# Altium project Arb_Power_Booster.PrjPcb (part 1 of 2)
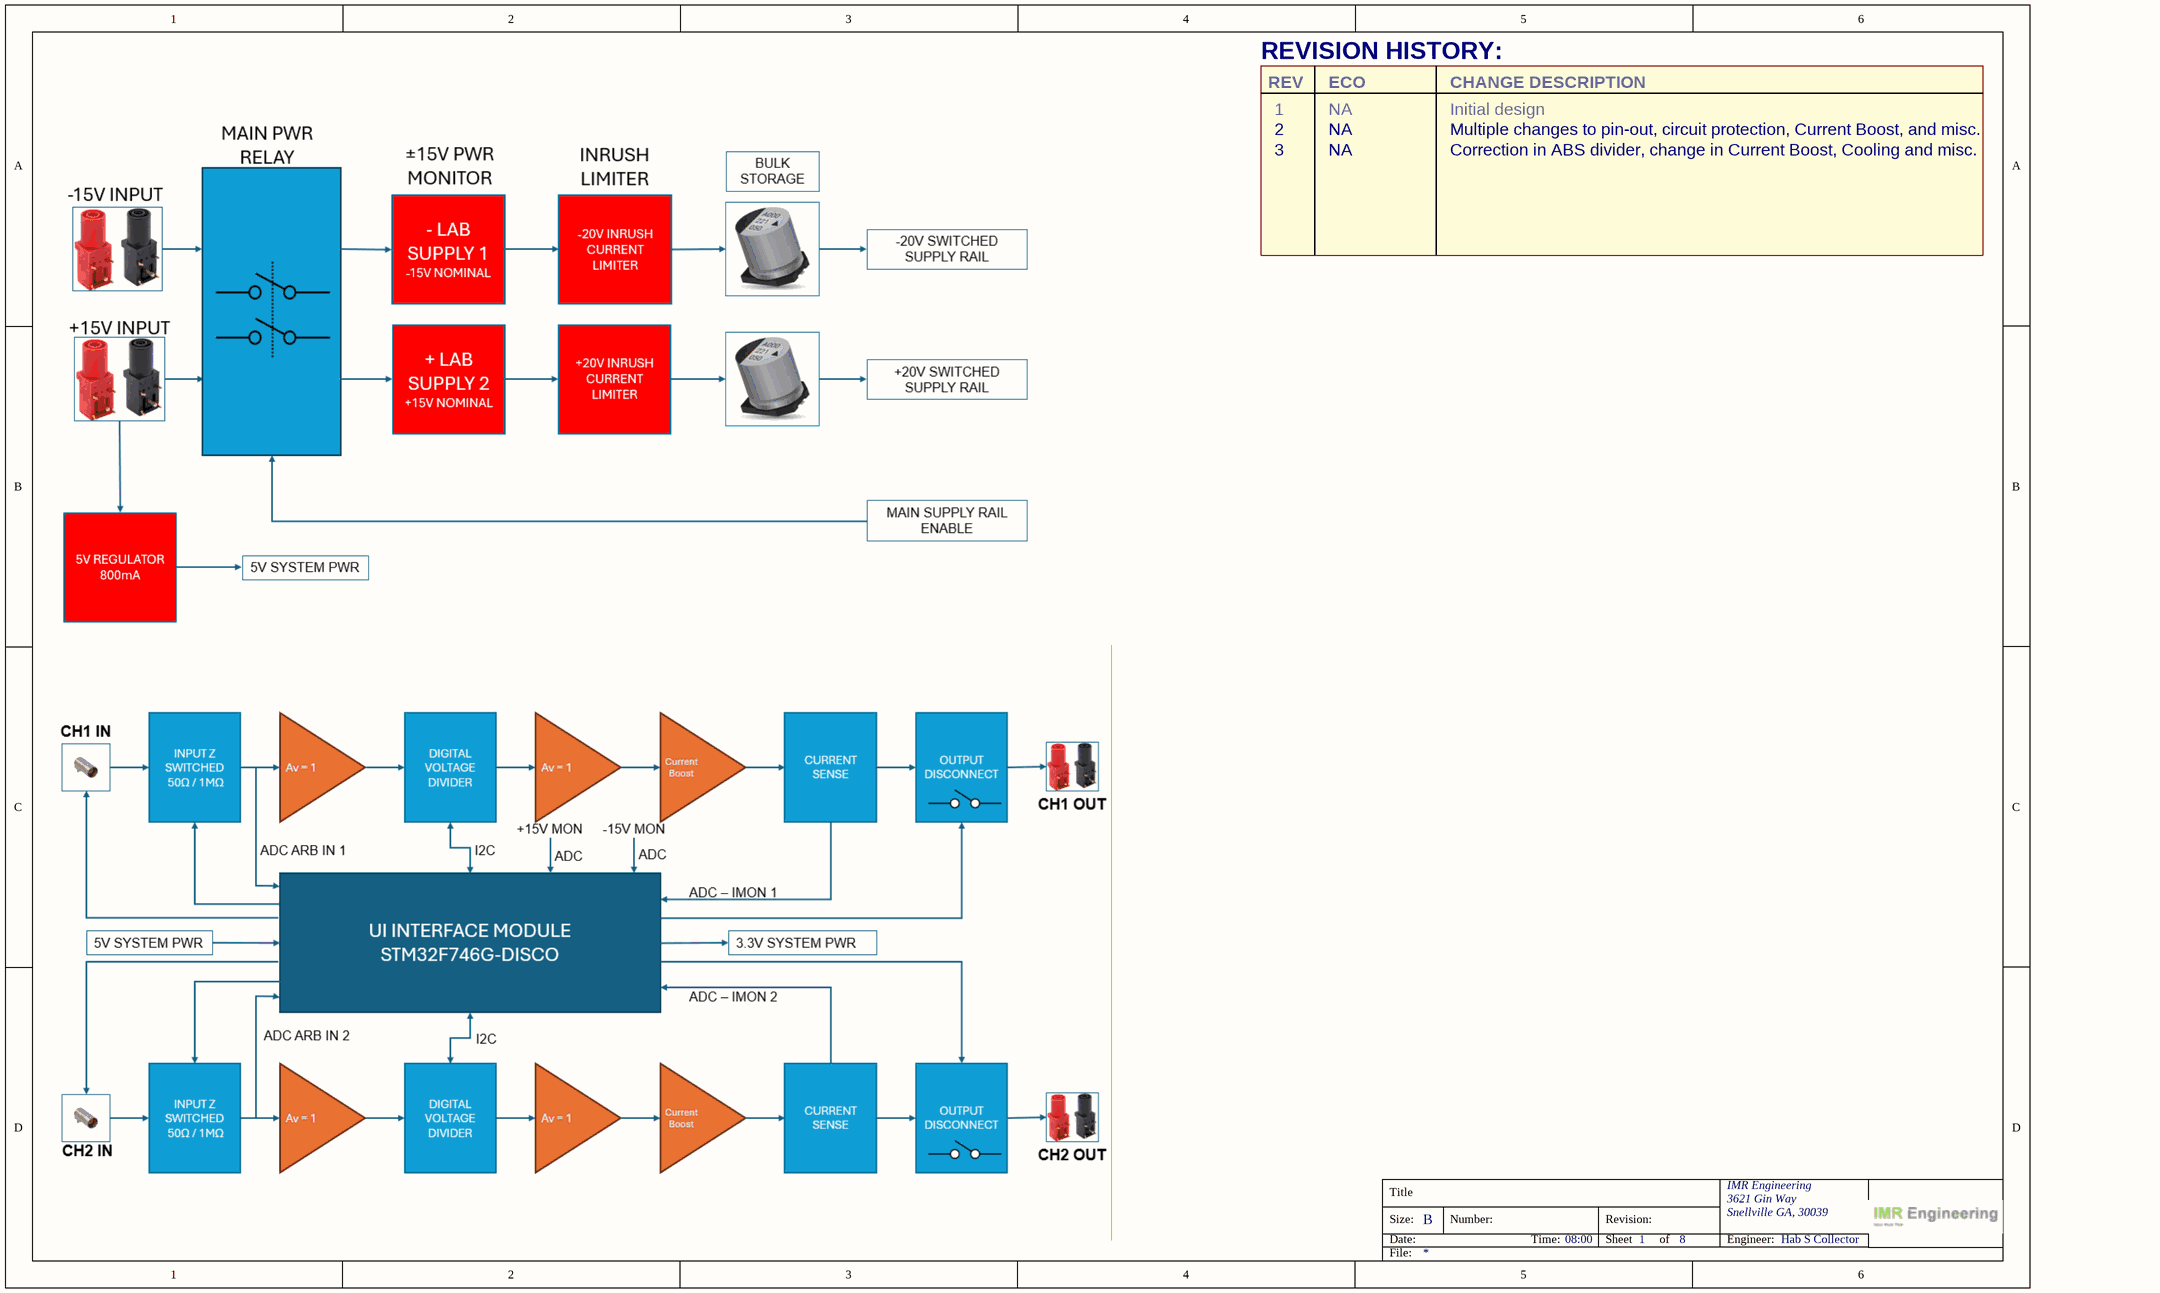
[diagram p0: ArbPwrBoost_P1.SchDoc]
ProjectTitle: Arbitrary Power Booster; ProjectTime: 08:00; ProjectRevision: 4; ProjectDocumentNumber: IMR-005-SCH; ProjectDate: 05/12/25
8 sheets, 228 parts. Net scope: global (net labels, ports and power ports of the same name join across sheets).
Sheets:
  ArbPwrBoost_P1.SchDoc
  ArbPwrBoost_P2.SchDoc
  ArbPwrBoost_P3.SchDoc
  ArbPwrBoost_P4.SchDoc
  ArbPwrBoost_P5.SchDoc
  ArbPwrBoost_P6.SchDoc
  ArbPwrBoost_P7.SchDoc
  ArbPwrBoost_P8.SchDoc

## Sheet ArbPwrBoost_P1.SchDoc: =ProjectTitle
size B; Date: 05/12/25; Engineer: Hab S Collector; Address1: 3621 Gin Way; Address2: Snellville GA, 30039; DocumentNumber: IMR-005-SCH; Revision: 4; SheetNumber: 1; SheetTotal: 8

### Notes on the sheet
- REVISION HISTORY:
- REV
- ECO
- CHANGE DESCRIPTION
- 1
- 2
- 3
- NA
- Initial design
- Multiple changes to pin-out, circuit protection, Current Boost, and misc.
- Correction in ABS divider, change in Current Boost, Cooling and misc.
- Title
- Size:
- Date:
- B
- Number:
- Time:
- Revision:
- Sheet
- of
- IMR Engineering
- Engineer:
- File:

## Sheet ArbPwrBoost_P2.SchDoc: =ProjectTitle
size B; Date: 05/12/25; Engineer: Hab S Collector; Address1: 3621 Gin Way; Address2: Snellville GA, 30039; DocumentNumber: IMR-005-SCH; Revision: 4; SheetNumber: 2; SheetTotal: 8
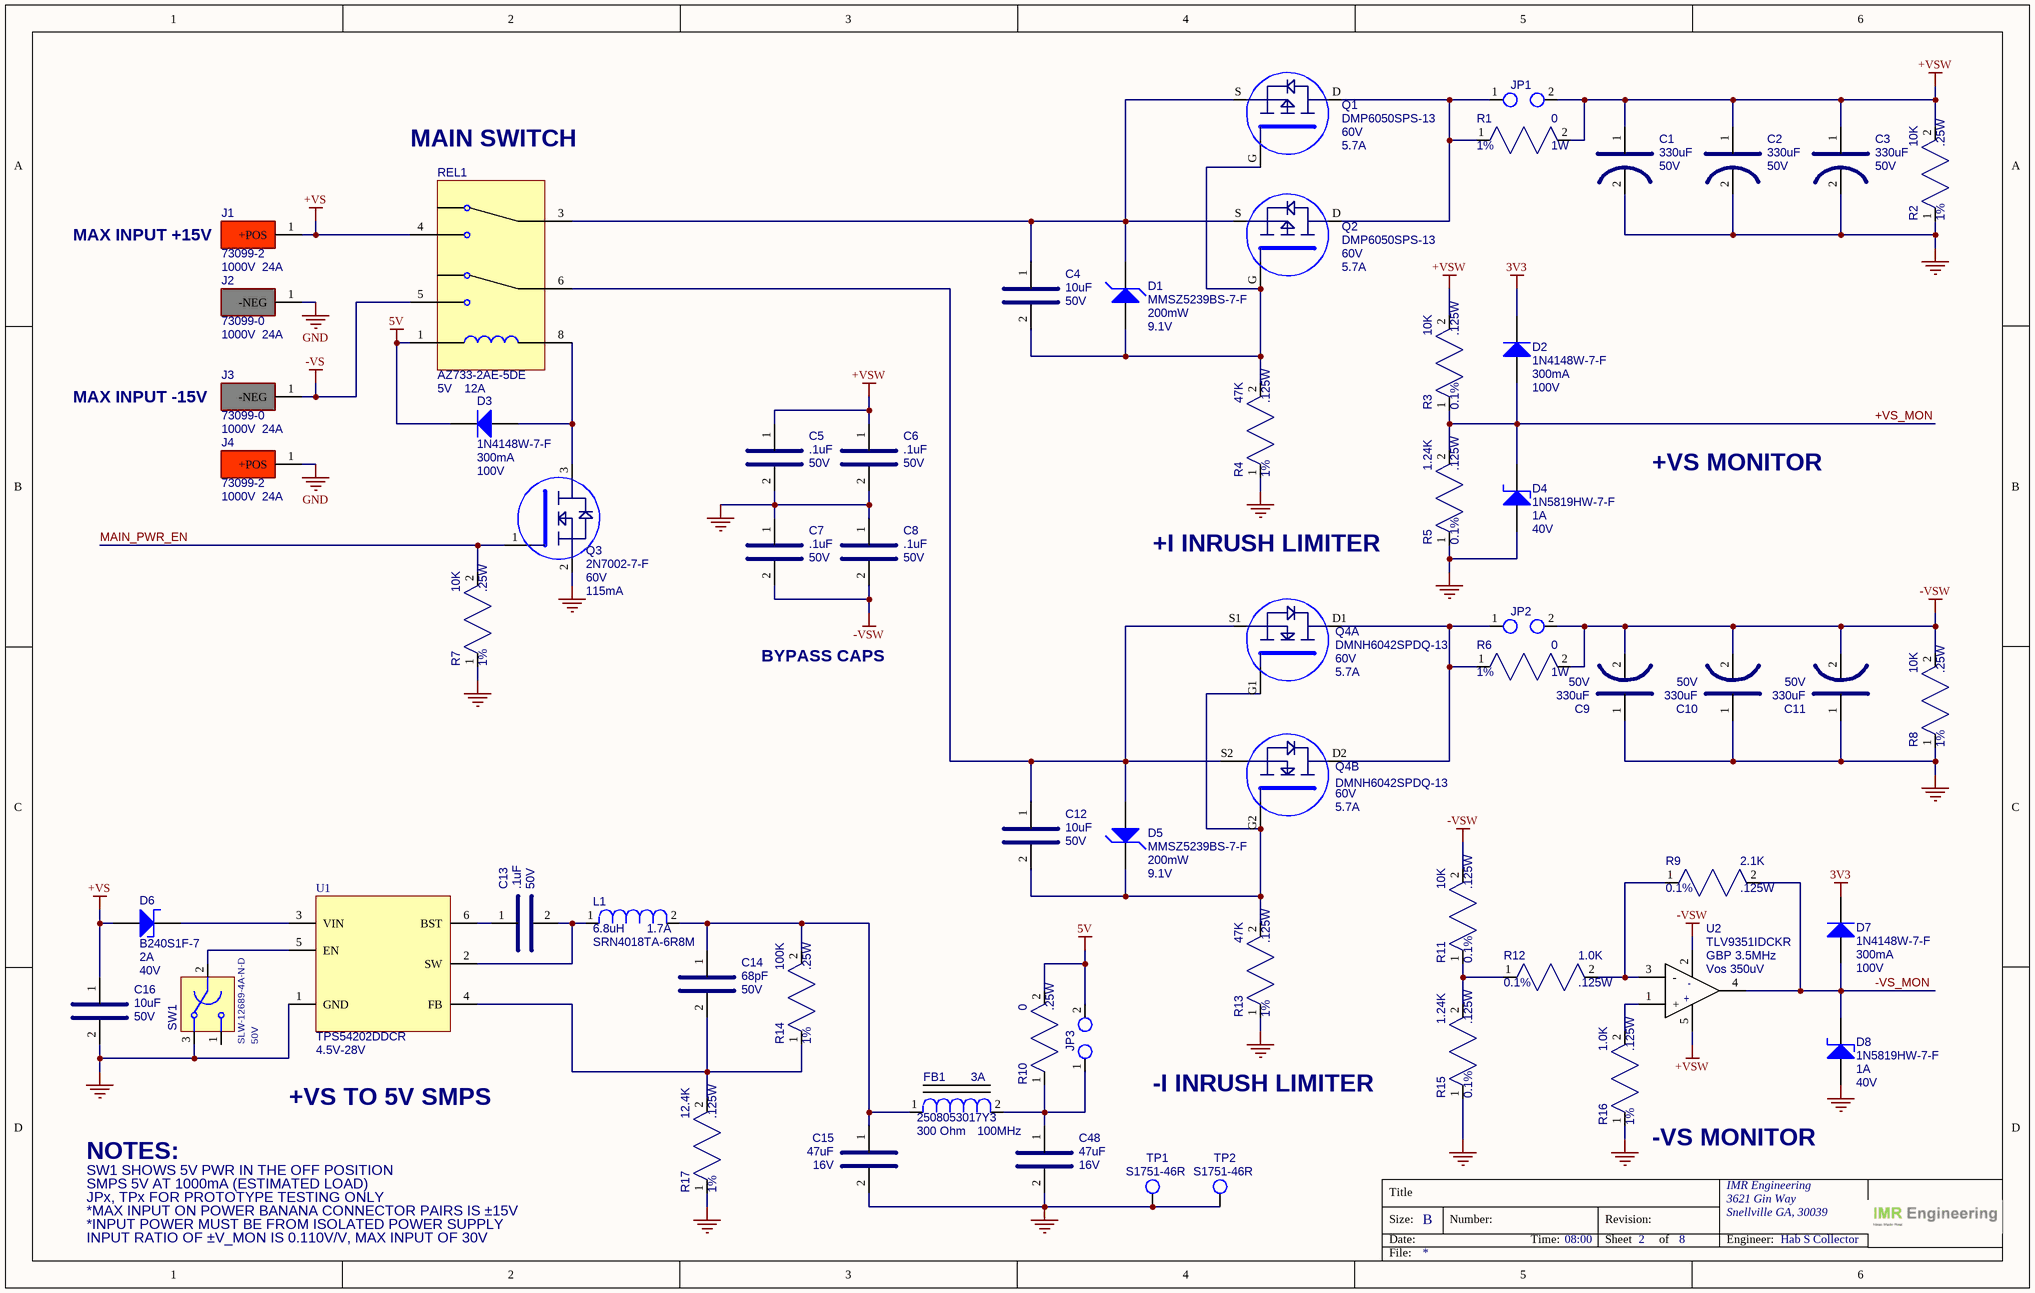
[diagram p1: ArbPwrBoost_P2.SchDoc]

### Parts
C1  value 330uF  Voltage: 50V  [PANASONIC_EEEFK0J332AQ]  (hidden comment: Panasonic Electronic)
C2  value 330uF  Voltage: 50V  [PANASONIC_EEEFK0J332AQ]  (hidden comment: Panasonic Electronic)
C3  value 330uF  Voltage: 50V  [PANASONIC_EEEFK0J332AQ]  (hidden comment: Panasonic Electronic)
C4  value 10uF  Voltage: 50V  [CAP_0805]  (hidden comment: GRM21BR61H106KE43L)
C5  value .1uF  Voltage: 50V  [CAP_0805]  (hidden comment: KGM21NR71H104KT)
C6  value .1uF  Voltage: 50V  [CAP_0805]  (hidden comment: KGM21NR71H104KT)
C7  value .1uF  Voltage: 50V  [CAP_0805]  (hidden comment: KGM21NR71H104KT)
C8  value .1uF  Voltage: 50V  [CAP_0805]  (hidden comment: KGM21NR71H104KT)
C9  value 330uF  Voltage: 50V  [PANASONIC_EEEFK0J332AQ]  (hidden comment: Panasonic Electronic)
C10  value 330uF  Voltage: 50V  [PANASONIC_EEEFK0J332AQ]  (hidden comment: Panasonic Electronic)
C11  value 330uF  Voltage: 50V  [PANASONIC_EEEFK0J332AQ]  (hidden comment: Panasonic Electronic)
C12  value 10uF  Voltage: 50V  [CAP_0805]  (hidden comment: GRM21BR61H106KE43L)
C13  value .1uF  Voltage: 50V  [CAP_0805]  (hidden comment: KGM21NR71H104KT)
C14  value 68pF  Voltage: 50V  [CAP_0805]  (hidden comment: C0805C680K5RACAUTO)
C15  value 47uF  Voltage: 16V  [CAP_1210]  (hidden comment: GRM32ER60J476ME20L)
C16  value 10uF  Voltage: 50V  [CAP_0805]  (hidden comment: GRM21BR61H106KE43L)
C48  value 47uF  Voltage: 16V  [CAP_1210]  (hidden comment: GRM32ER60J476ME20L)
D1  value 9.1V  Power: 200mW  [SOD323]  (hidden comment: MMSZ5239BS-7-F)
D2  value 100V  Current: 300mA  [SOD123]  (hidden comment: 1N4148W-7-F)
D3  value 100V  Current: 300mA  [SOD123]  (hidden comment: 1N4148W-7-F)
D4  value 40V  Current: 1A  [SOD123]  (hidden comment: 1N5819HW-7-F)
D5  value 9.1V  Power: 200mW  [SOD323]  (hidden comment: MMSZ5239BS-7-F)
D6  value 40V  Current: 2A  [SOD123F]  (hidden comment: B240S1F-7)
D7  value 100V  Current: 300mA  [SOD123]  (hidden comment: 1N4148W-7-F)
D8  value 40V  Current: 1A  [SOD123]  (hidden comment: 1N5819HW-7-F)
FB1  value 300 Ohm  Frequency: 100MHz  Current: 3A  [FERRITE_0805]  (hidden comment: 2508053017Y3)
J1  value 1000V  Current: 24A  [Pomona_73099-2]  (hidden comment: 73099-2)
J2  value 1000V  Current: 24A  [Pomona_73099-0]  (hidden comment: 73099-0)
J3  value 1000V  Current: 24A  [Pomona_73099-0]  (hidden comment: 73099-0)
J4  value 1000V  Current: 24A  [Pomona_73099-2]  (hidden comment: 73099-2)
JP1  PREC002SFAN-RC  [HDR_1X2_100MILL]  (value not drawn)
JP2  PREC002SFAN-RC  [HDR_1X2_100MILL]  (value not drawn)
JP3  PREC002SFAN-RC  [HDR_1X2_100MILL]  (value not drawn)
L1  value 6.8uH  Current: 1.7A  [SRN4018TA]  (hidden comment: SRN4018TA-6R8M)
Q1  value 60V  Current: 5.7A  [DMP3007SPS13]  (hidden comment: DMP6050SPS-13)
Q2  value 60V  Current: 5.7A  [DMP3007SPS13]  (hidden comment: DMP6050SPS-13)
Q3  value 60V  Current: 115mA  [SOT-23]  (hidden comment: 2N7002-7-F)
Q4  value 60V  Current: 5.7A  [TRANS_DMP2002UPS-13]  (hidden comment: DMNH6042SPDQ-13)  (parts A,B of 2)
R1  value 0  Tolerance: 1%  Power: 1W  [RES_2512]  (hidden comment: RC2512JK-070RL)
R2  value 10K  Power: .25W  Tolerance: 1%  [RES_0805]  (hidden comment: RC0805FR-7W10KL)
R3  value 10K  Power: .125W  Tolerance: 0.1%  [RES_0805]  (hidden comment: RP0805BRD0710KL)
R4  value 47K  Power: .125W  Tolerance: 1%  [RES_0805]  (hidden comment: RC0805FR-1347KL)
R5  value 1.24K  Power: .125W  Tolerance: 0.1%  [RES_0805]  (hidden comment: RT0805BRD071K24L)
R6  value 0  Tolerance: 1%  Power: 1W  [RES_2512]  (hidden comment: RC2512JK-070RL)
R7  value 10K  Power: .25W  Tolerance: 1%  [RES_0805]  (hidden comment: RC0805FR-7W10KL)
R8  value 10K  Power: .25W  Tolerance: 1%  [RES_0805]  (hidden comment: RC0805FR-7W10KL)
R9  value 2.1K  Power: .125W  Tolerance: 0.1%  [RES_0805]  (hidden comment: RT0805BRD072K1L)
R10  value 0  Power: .25W  [RES_0805]  (hidden comment: RC0805JR-070RL)
R11  value 10K  Power: .125W  Tolerance: 0.1%  [RES_0805]  (hidden comment: RP0805BRD0710KL)
R12  value 1.0K  Power: .125W  Tolerance: 0.1%  [RES_0805]  (hidden comment: RT0805BRD071KL)
R13  value 47K  Power: .125W  Tolerance: 1%  [RES_0805]  (hidden comment: RC0805FR-1347KL)
R14  value 100K  Power: .25W  Tolerance: 1%  [RES_0805]  (hidden comment: RC0805FR-07100KL)
R15  value 1.24K  Power: .125W  Tolerance: 0.1%  [RES_0805]  (hidden comment: RT0805BRD071K24L)
R16  value 1.0K  Power: .125W  Tolerance: 1%  [RES_0805]  (hidden comment: RC0805FR-071KL)
R17  value 12.4K  Power: .125W  Tolerance: 1%  [RES_0805]  (hidden comment: RC0805FR-0712K4L)
REL1  value 5V  Current: 12A  [AZ733]  (hidden comment: AZ733-2AE-5DE)
SW1  value 50V  [SLW126894AND]  (hidden comment: SLW-12689-4A-N-D)
TP1  S1751-46R  [HARWIN_S1751]
TP2  S1751-46R  [HARWIN_S1751]
U1  value 4.5V-28V  [SOT-23-6]  (hidden comment: TPS54202DDCR)
U2  value GBP 3.5MHz  Vos: Vos 350uV  [SOT-353]  (hidden comment: TLV9351IDCKR)

### Nets
3V3: D2.2(K) D7.2(K)
5V: D3.2(K) JP3.2 R10.2 REL1.1
+VS: C16.1 D6.1(A) J1.1(+POS) REL1.4
+VSW: C1.1 C2.1 C3.1 C5.1 C6.1 JP1.2 R1.2 R2.2 R3.2 U2.5
-VS: J3.1(-NEG) REL1.5
-VSW: C7.2 C8.2 C9.2 C10.2 C11.2 JP2.2 R6.2 R8.2 R11.2 U2.2
GND: C1.2 C2.2 C3.2 C5.2 C6.2 C7.1 C8.1 C9.1 C10.1 C11.1 C15.2 C16.2 C48.2 D4.1(A) D8.1(A) J2.1(-NEG) J4.1(+POS) Q3.2(E) R2.1 R4.1 R5.1 R7.1 R8.1 R13.1 R15.1 R16.1 R17.1 SW1.3 TP1.1 TP2.1 U1.1(GND)
+VS_MON: D2.1(A) D4.2(K) R3.1 R5.2
-VS_MON: D7.1(A) D8.2(K) R9.2 U2.4
MAIN_PWR_EN: Q3.1(B) R7.2
NetC4_1: C4.1 D1.2(K) Q1.S Q2.S REL1.3
NetC4_2: C4.2 D1.1(A) Q1.G Q2.G R4.2
NetC12_1: C12.1 D5.1(A) Q4.S1(S) Q4.S2(S) REL1.6
NetC12_2: C12.2 D5.2(K) Q4.G1(G) Q4.G2 R13.2
NetC13_1: C13.1 U1.6(BST)
NetC13_2: C13.2 L1.1 U1.2(SW)
NetC14_1: C14.1 C15.1 FB1.1 L1.2 R14.2
NetC14_2: C14.2 R14.1 R17.2 U1.4(FB)
NetC48_1: C48.1 FB1.2 JP3.1 R10.1
NetD3_1: D3.1(A) Q3.3(C) REL1.8
NetD6_2: D6.2(K) U1.3(VIN)
NetJP1_1: JP1.1 Q1.D Q2.D R1.1
NetJP2_1: JP2.1 Q4.D1(D) Q4.D2(D) R6.1
NetR9_1: R9.1 R12.2 U2.3(-)
NetR11_1: R11.1 R12.1 R15.2
NetR16_2: R16.2 U2.1(+)
NetSW1_2: SW1.2 U1.5(EN)

Not connected (* = marked no-connect by the designer): SW1 1

### Notes on the sheet
- MAIN SWITCH
- MAX INPUT +15V
- MAX INPUT -15V
- +VS MONITOR
- +I INRUSH LIMITER
- BYPASS CAPS
- +VS TO 5V SMPS
- -I INRUSH LIMITER
- NOTES:
- SW1 SHOWS 5V PWR IN THE OFF POSITION
- (near R16) -VS MONITOR
- JPx, TPx FOR PROTOTYPE TESTING ONLY
- *MAX INPUT ON POWER BANANA CONNECTOR PAIRS IS ±15V
- *INPUT POWER MUST BE FROM ISOLATED POWER SUPPLY
- INPUT RATIO OF ±V_MON IS 0.110V/V, MAX INPUT OF 30V
- SMPS 5V AT 1000mA (ESTIMATED LOAD)
- Title
- Size:
- Date:
- B
- Number:
- Time:
- Revision:
- Sheet
- of
- IMR Engineering
- Engineer:
- File:

### Library data of the parts
C1-C3 C9-C11 = CAP_330UF_50V_ALE: CAP ALE 330UF 20% 50V SMD; MFG: EEV-FK1H331Q; Case/Package: Radial SMD; MFG_PN: Panasonic Electronic; Supplier 1: DigiKey; Supplier Part Number 1: PCE3475CT-ND; Unit Price: 1.41
C4 C12 C16 = CAP_SMD_10UF_50V_0805: CAP CER 10UF 50V X5R 0805; MFG: Murata Electronics; Case/Package: 0805; MFG_PN: GRM21BR61H106KE43L; Supplier 1: DigiKey; Supplier Part Number 1: 490-18663-1-ND; Unit Price: .28
C5-C8 C13 = CAP_SMD_0.1UF_50V_0805: CAP CER 0.1UF 50V X7R 0805; MFG: KYOCERA AVX; Case/Package: 0805; MFG_PN: KGM21NR71H104KT; Supplier 1: DigiKey; Supplier Part Number 1: 478-KGM21NR71H104KTCT-ND; Unit Price: .1
C14 = CAP_SMD_68PF_50V_0805: CAP CER 68PF 50V X7R 0805; MFG: KEMET; Case/Package: 0805; MFG_PN: C0805C680K5RACAUTO; Supplier 1: DigiKey; Supplier Part Number 1: 399-C0805C680K5RACAUTOCT-ND; Unit Price: .24
C15 C48 = CAP_SMD_47UF_16V_1210: CAP CER 47UF 50V X5R 1210; MFG: Murata Electronics; Case/Package: 1210; MFG_PN: GRM32ER60J476ME20L; Supplier 1: DigiKey; Supplier Part Number 1: 490-1887-1-ND; Unit Price: .28
D1 D5 = DIODE_ZENER_MMSZ5239BS-7-F: DIODE ZENER 9.1V 200MW SOD323; MFG: Diodes Inc; Case/Package: SOD-123; Supplier 1: DigiKey; Supplier Part Number 1: MMSZ5239BS-FDICT-ND; Unit Price: .18; MFG_PN: MMSZ5239BS-7-F
D2 D3 D7 = DIODE_1N4148W-7-F: RELAY REED SPDT 250MA 5V; MFG: Diodes Inc; Case/Package: SOD-123; Supplier 1: DigiKey; Supplier Part Number 1: 1N4148W-FDICT-ND; Unit Price: .16; MFG_PN: 1N4148W-7-F
D4 D8 = DIODE_SCHOTTKY_1N5819HW-7-F: DIODE SCHOTTKY 40V 1A SOD123; MFG: Diodes Inc; Case/Package: SOD-123; Supplier 1: DigiKey; Supplier Part Number 1: 1N5819HW-FDICT-ND; Unit Price: .25; MFG_PN: 1N5819HW-7-F
D6 = DIODE_SCHOTTKY_B240S1F-7: DIODE SCHOTTKY 40V 2A SOD123F; MFG: Diodes Inc; Case/Package: SOD-123F; Supplier 1: DigiKey; Supplier Part Number 1: B240S1F-7DICT-ND; Unit Price: .25; MFG_PN: B240S1F-7
FB1 = FERRITE_2508053017Y3: FERRITE BEAD 300 OHM 0805 1LN; MFG: Fair-Rite; Case/Package: 0805; Supplier 1: DigiKey; Supplier Part Number 1: 1934-1474-1-ND; Unit Price: .10; MFG_PN: 2508053017Y3
J1 J4 = CONN_PANOMA_73099-2: CONN 4mm Banana Socket Right Angle PCB RED; MFG: Pomona; Case/Package: 73099-2; Supplier 1: DigiKey; Supplier Part Number 1: 501-73099-2-ND; Unit Price: 10.39; MFG_PN: 73099-2
J2 J3 = CONN_PANOMA_73099-0: CONN 4mm Banana Socket Right Angle PCB BLK; MFG: Pomona; Case/Package: 73099-0; Supplier 1: DigiKey; Supplier Part Number 1: 501-73099-0-ND; Unit Price: 10.39; MFG_PN: 73099-0
JP1-JP3 = CONN_JUMPER_2P_100MIL_VERT: CONN HEADER VERT 2POS 2.54MM; MFG: Sullins Connector Solutions; Case/Package: 2P_2.54MM; MFG_PN: PREC002SFAN-RC; Supplier 1: Digi-Key; Supplier Part Number 1: S1212EC-02-ND; Value: *; Unit Price: .07
L1 = INDUCTOR_SRN4018TA-6R8M: FIXED IND 6.8UH 1.7A 98 MOHM SMD; MFG: Bourns Inc.; Tolerance: 20%; Case/Package: SRN4018TA; Supplier 1: DigiKey; Supplier Part Number 1: SRN4018TA-6R8MCT-ND; Unit Price: .48; MFG_PN: SRN4018TA-6R8M
Q1 Q2 = MOSFET_PCH_DMP6050SPS-13: MOSFET P-CH 60V 5.7A PWRDI5060-8; MFG: Diodes Inc; Case/Package: 8-PowerTDFN; Supplier 1: DigiKey; Supplier Part Number 1: DMP6050SPS-13DICT-ND; Unit Price: 1.07; MFG_PN: DMP6050SPS-13
Q3 = MOSFET_NCH_2N7002-7-F: MOSFET N-CH 60V 115MA SOT23-3; MFG: Diodes Inc; Case/Package: SOT-23; Supplier 1: DigiKey; Supplier Part Number 1: 2N7002-FDICT-ND; Unit Price: .20; MFG_PN: 2N7002-7-F
Q4 = MOSFET_NCH_DMNH6042SPDQ-13: MOSFET NCH 60V 5.7A POWERDI; MFG: Diodes Inc; Case/Package: 8-PowerTDFN; Supplier 1: DigiKey; Supplier Part Number 1: DMNH6042SPDQ-13DICT-ND; Unit Price: 1.36; MFG_PN: DMNH6042SPDQ-13
R1 R6 = RES_SMD_0_2512_1W_1%: RES SMD 0 OHM 1% 1W 2512; MFG: Yageo; Case/Package: 2512; MFG_PN: RC2512JK-070RL; Supplier 1: DigiKey; Supplier Part Number 1: YAG1232CT-ND; Unit Price: .2
R2 R7 R8 = RES_SMD_10K_0805_1/4W_1%: RES SMD 10K OHM 1% 1/4W 0805; MFG: Yageo; Case/Package: 0805; MFG_PN: RC0805FR-7W10KL; Supplier 1: DigiKey; Supplier Part Number 1: 13-RC0805FR-7W10KLCT-ND; Unit Price: .10
R3 R11 = RES_SMD_10K_0805_1/8W_0.1%: RES SMD 10K OHM 0.1% 1/8W 0805; MFG: Yageo; Case/Package: 0805; MFG_PN: RP0805BRD0710KL; Supplier 1: DigiKey; Supplier Part Number 1: 13-RP0805BRD0710KLCT-ND; Unit Price: .16
R4 R13 = RES_SMD_47K_0805_1/8W_1%: RES SMD 47K OHM 1% 1/8W 0805; MFG: Yageo; Case/Package: 0805; MFG_PN: RC0805FR-1347KL; Supplier 1: DigiKey; Supplier Part Number 1: 13-RC0805FR-1347KLCT-ND; Unit Price: .1
R5 R15 = RES_SMD_1.24K_0805_1/8W_0.1%: RES SMD 1.24K OHM 0.1% 1/8W 0805; MFG: Yageo; Case/Package: 0805; MFG_PN: RT0805BRD071K24L; Supplier 1: DigiKey; Supplier Part Number 1: YAG1809CT-ND; Unit Price: .16
R9 = RES_SMD_2.1K_0805_1/8W_0.1%: RES SMD 2.1K OHM 0.1% 1/8W 0805; MFG: Yageo; Case/Package: 0805; MFG_PN: RT0805BRD072K1L; Supplier 1: DigiKey; Supplier Part Number 1: YAG1852CT-ND; Unit Price: .16
R10 = RES_SMD_0_0805_1/8W_1%: RES SMD 0 OHM 1% 1/8W 0805; MFG: Yageo; Case/Package: 0805; MFG_PN: RC0805JR-070RL; Supplier 1: DigiKey; Supplier Part Number 1: 311-0.0ARCT-ND; Unit Price: .1; Tolerance: 1%
R12 = RES_SMD_1.0K_0805_1/8W_0.1%: RES SMD 1.0K OHM 0.1% 1/8W 0805; MFG: Yageo; Case/Package: 0805; MFG_PN: RT0805BRD071KL; Supplier 1: DigiKey; Supplier Part Number 1: YAG1820CT-ND; Unit Price: .16
R14 = RES_SMD_100K_0805_1/4W_1%: RES SMD 100K OHM 1% 1/4W 0805; MFG: Yageo; Case/Package: 0805; MFG_PN: RC0805FR-07100KL; Supplier 1: DigiKey; Supplier Part Number 1: 311-100KCRCT-ND; Unit Price: .13
R16 = RES_SMD_1.0K_0805_1/8W_1%: RES SMD 1.0K OHM 1% 1/8W 0805; MFG: Yageo; Case/Package: 0805; MFG_PN: RC0805FR-071KL; Supplier 1: DigiKey; Supplier Part Number 1: 311-1.00KCRCT-ND; Unit Price: .1
R17 = RES_SMD_12.4K_0805_1/8W_1%: RES SMD 12.4K OHM 1% 1/8W 0805; MFG: Yageo; Case/Package: 0805; MFG_PN: RC0805FR-0712K4L; Supplier 1: DigiKey; Supplier Part Number 1: 311-12.4KCRCT-ND; Unit Price: .10
REL1 = RELAY_AZ733-2AE-5DE: RELAY REED SPDT 250MA 5V; MFG: American Zettler; Case/Package: AZ733; Supplier 1: DigiKey; Supplier Part Number 1: 3385-AZ733-2AE-5DE-nd; Unit Price: 2.18; MFG_PN: AZ733-2AE-5DE
SW1 = SWITCH_SLW-12689-4A-N-D: SWITCH SLIDE SPDT 300MA 50V; MFG: Same Sky; Case/Package: SLW-12689-4A-N-D; Supplier 1: DigiKey; Supplier Part Number 1: 2223-SLW-12689-4A-N-D-ND; Unit Price: .48; Current: 300mA; MFG_PN: SLW-12689-4A-N-D
TP1 TP2 = CONN_TEST_POINT_S1751-46R: PCB TEST POINT CONNECT; MFG: Harwin Inc; Case/Package: S1751; MFG_PN: S1751-46R; Supplier 1: Digi-Key; Supplier Part Number 1: 952-1478-1-ND; Value: *; Unit Price: .28
U1 = IC_TPS54202DDCR: IC REG BUCK ADJ 2A SOT23; MFG: Texas Instruments; Case/Package: SOT-23-6; Supplier 1: Digi-Key; Supplier Part Number 1: 296-TPS54202DDCRCT-ND; Unit Price: .97; MFG_PN: TPS54202DDCR
U2 = OPAMP_TLV9351IDCKR: IC OPAMP GP 3.5MHZ 350uV C70-5; MFG: Texas Instruments; Package/Case: SOT-353; Supplier 1: DigiKey; MFG_PN: TLV9351IDCKR; Unit Price: .49; Supplier Part Number 1: 296-TLV9351IDCKRCT-ND

## Sheet ArbPwrBoost_P3.SchDoc: =ProjectTitle
size B; Date: 05/12/25; Engineer: Hab Collector; Organization: Altium Limited; Address1: 3621 Gin Way; Address2: Snellville, GA 30039; DocumentNumber: IMR-005-SCH; Revision: 4; SheetNumber: 3; SheetTotal: 8
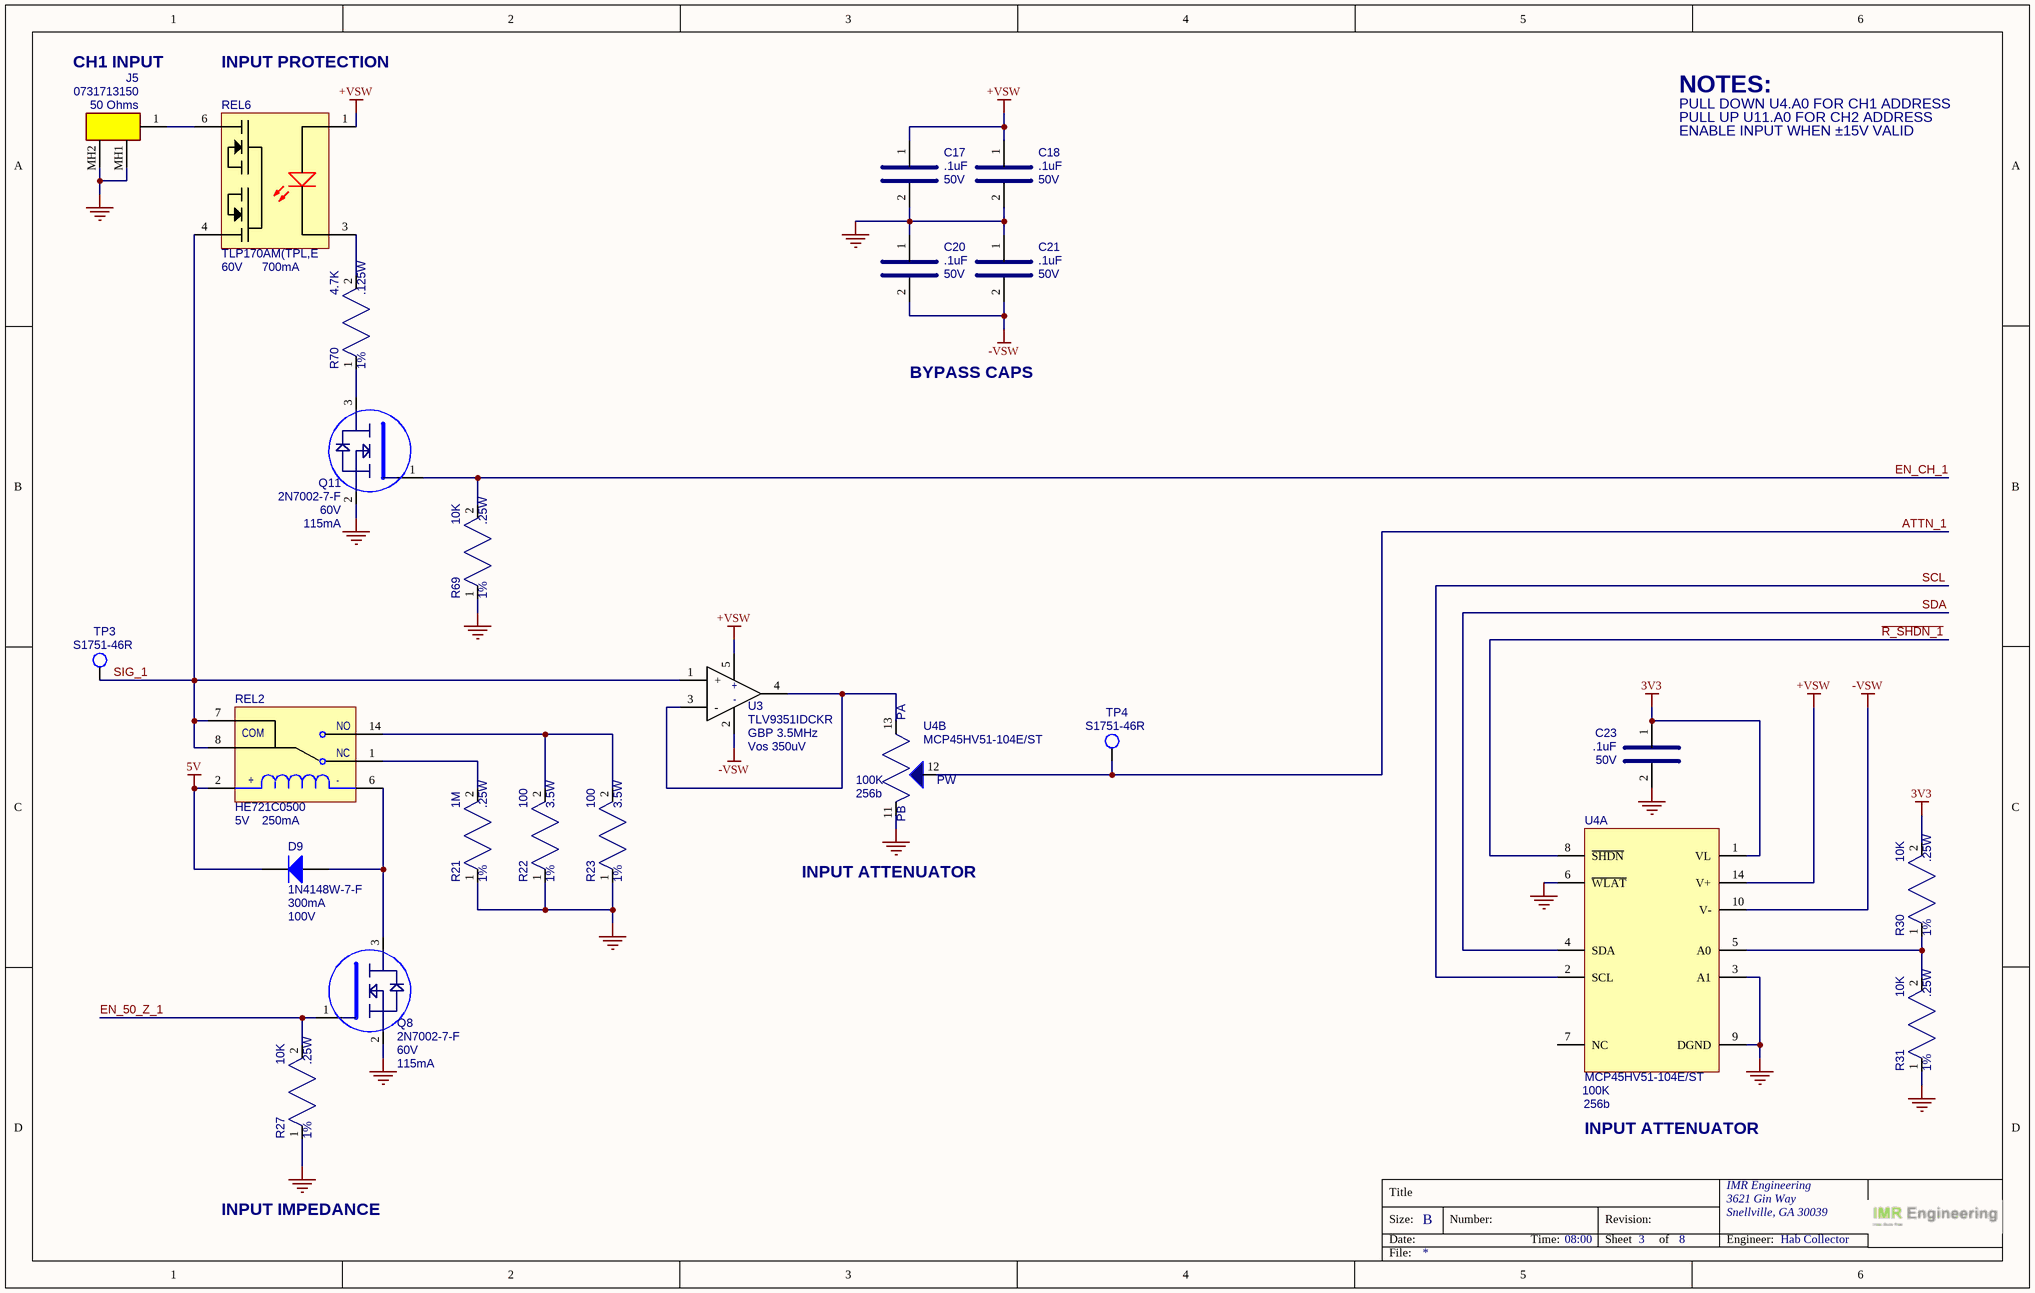
[diagram p2: ArbPwrBoost_P3.SchDoc]

### Parts
C17  value .1uF  Voltage: 50V  [CAP_0805]  (hidden comment: KGM21NR71H104KT)
C18  value .1uF  Voltage: 50V  [CAP_0805]  (hidden comment: KGM21NR71H104KT)
C20  value .1uF  Voltage: 50V  [CAP_0805]  (hidden comment: KGM21NR71H104KT)
C21  value .1uF  Voltage: 50V  [CAP_0805]  (hidden comment: KGM21NR71H104KT)
C23  value .1uF  Voltage: 50V  [CAP_0805]  (hidden comment: KGM21NR71H104KT)
D9  value 100V  Current: 300mA  [SOD123]  (hidden comment: 1N4148W-7-F)
J5  value 50 Ohms  [731713150]  (hidden comment: 0731713150)
Q8  value 60V  Current: 115mA  [SOT-23]  (hidden comment: 2N7002-7-F)
Q11  value 60V  Current: 115mA  [SOT-23]  (hidden comment: 2N7002-7-F)
R21  value 1M  Power: .25W  Tolerance: 1%  [RES_0805]  (hidden comment: RC0805FR-7W1ML)
R22  value 100  Power: 3.5W  Tolerance: 1%  [RES_2512]  (hidden comment: ALN2512F100RE-1)
R23  value 100  Power: 3.5W  Tolerance: 1%  [RES_2512]  (hidden comment: ALN2512F100RE-1)
R27  value 10K  Power: .25W  Tolerance: 1%  [RES_0805]  (hidden comment: RC0805FR-7W10KL)
R30  value 10K  Power: .25W  Tolerance: 1%  [RES_0805]  (hidden comment: RC0805FR-7W10KL)
R31  value 10K  Power: .25W  Tolerance: 1%  [RES_0805]  (hidden comment: RC0805FR-7W10KL)
R69  value 10K  Power: .25W  Tolerance: 1%  [RES_0805]  (hidden comment: RC0805FR-7W10KL)
R70  value 4.7K  Power: .125W  Tolerance: 1%  [RES_0805]  (hidden comment: RC0805FR-134K7L)
REL2  value 5V  Current: 250mA  [HE700]  (hidden comment: HE721C0500)
REL6  value 60V  Current: 700mA  [SOP-6]  (hidden comment: TLP170AM(TPL,E)
TP3  S1751-46R  [HARWIN_S1751]
TP4  S1751-46R  [HARWIN_S1751]
U3  value GBP 3.5MHz  Vos: Vos 350uV  [SOT-353]  (hidden comment: TLV9351IDCKR)
U4  value 100K  TAP: 256b  [TSSOP-14]  (hidden comment: MCP45HV51-104E/ST)  (parts A,B of 2)

### Nets
3V3: C23.1 R30.2 U4.1(VL)
5V: D9.2(K) REL2.2
+VSW: C17.1 C18.1 REL6.1 U3.5 U4.14(V+)
-VSW: C20.2 C21.2 U3.2 U4.10(V-)
GND: C17.2 C18.2 C20.1 C21.1 C23.2 J5.MH1 J5.MH2 Q8.2(E) Q11.2(E) R21.1 R22.1 R23.1 R27.1 R31.1 R69.1 U4.3(A1) U4.6(~{WLAT}) U4.9(DGND) U4.11(PB0)
~{R_SHDN_1}: U4.8(~{SHDN})
ATTN_1: TP4.1 U4.12(PW0)
EN_50_Z_1: Q8.1(B) R27.2
EN_CH_1: Q11.1(B) R69.2
SCL: U4.2(SCL)
SDA: U4.4(SDA)
SIG_1: REL2.7(COM) REL2.8(COM) REL6.4 TP3.1 U3.1(+)
NetD9_1: D9.1(A) Q8.3(C) REL2.6
NetJ5_1: J5.1 REL6.6
NetQ11_3: Q11.3(C) R70.1
NetR21_2: R21.2 REL2.1(NC)
NetR22_2: R22.2 R23.2 REL2.14(NO)
NetR30_1: R30.1 R31.2 U4.5(A0)
NetR70_2: R70.2 REL6.3
NetU3_3: U3.3(-) U3.4 U4.13(PA)

Not connected (* = marked no-connect by the designer): U4 7(NC)

### Notes on the sheet
- CH1 INPUT
- INPUT PROTECTION
- NOTES:
- PULL DOWN U4.A0 FOR CH1 ADDRESS
- PULL UP U11.A0 FOR CH2 ADDRESS
- ENABLE INPUT WHEN ±15V VALID
- BYPASS CAPS
- INPUT ATTENUATOR
- INPUT IMPEDANCE
- Title
- Size:
- Date:
- B
- Number:
- Time:
- Revision:
- Sheet
- of
- IMR Engineering
- Engineer:
- File:
- (in symbol IC_MCP45HV51-104E/ST, part B) PW; PB
- (in symbol RELAY_HE721C0500) +; -

### Library data of the parts
C17 C18 C20 C21 C23 = CAP_SMD_0.1UF_50V_0805: as C5 on sheet ArbPwrBoost_P2; Case/Package: 0805; MFG_PN: KGM21NR71H104KT; Supplier 1: DigiKey; Supplier Part Number 1: 478-KGM21NR71H104KTCT-ND; Unit Price: .1
D9 = DIODE_1N4148W-7-F: as D2 on sheet ArbPwrBoost_P2; Case/Package: SOD-123; Supplier 1: DigiKey; Supplier Part Number 1: 1N4148W-FDICT-ND; Unit Price: .16; MFG_PN: 1N4148W-7-F
J5 = CONN_MOLEX_0731713150: CONN BNC RCPT R/A 50 OHM PCB; MFG: Molex; Case/Package: 73099-2; Supplier 1: DigiKey; Supplier Part Number 1: WM20430-ND; Unit Price: 1.40; MFG_PN: 0731713150
Q8 Q11 = MOSFET_NCH_2N7002-7-F: as Q3 on sheet ArbPwrBoost_P2; Case/Package: SOT-23; Supplier 1: DigiKey; Supplier Part Number 1: 2N7002-FDICT-ND; Unit Price: .20; MFG_PN: 2N7002-7-F
R21 = RES_SMD_1M_0805_1/4W_1%: RES SMD 1K OHM 1% 1/4W 0805; MFG: Yageo; Case/Package: 0805; MFG_PN: RC0805FR-7W1ML; Supplier 1: DigiKey; Supplier Part Number 1: 13-RC0805FR-7W1MLCT-ND; Unit Price: .10
R22 R23 = RES_SMD_100_0805_3.5W_1%: RES SMD 100 OHM 1% 3.5W 2512; MFG: Ohmite; Case/Package: 2512; MFG_PN: ALN2512F100RE-1; Supplier 1: DigiKey; Supplier Part Number 1: 273-ALN2512F100RE-1CT-ND; Unit Price: 1.50
R27 R30 R31 R69 = RES_SMD_10K_0805_1/4W_1%: RES SMD 10K OHM 1% 1/4W 0805; MFG: Yageo; Case/Package: 0805; MFG_PN: RC0805FR-7W10KL; Supplier 1: DigiKey; Supplier Part Number 1: 13-RC0805FR-7W10KLCT-ND; Unit Price: .10
R70 = RES_SMD_4.7K_0805_1/8W_1%: RES SMD 4.7K OHM 1% 1/8W 0805; MFG: Yageo; Case/Package: 0805; MFG_PN: RC0805FR-134K7L; Supplier 1: DigiKey; Supplier Part Number 1: 13-RC0805FR-134K7LCT-ND; Unit Price: .1
REL2 = RELAY_HE721C0500: RELAY REED SPDT 250MA 5V; MFG: Littlefuse; Case/Package: HE700; Supplier 1: DigiKey; Supplier Part Number 1: HE112-ND; Unit Price: 3.77; MFG_PN: HE721C0500
REL6 = RELAY_TLP170AM(TPL,E: SSR RELAY SPST-NO 700MA 0-60V; MFG: Toshiba; Case/Package: SOP-6; Supplier 1: DigiKey; Supplier Part Number 1: 264-TLP170AM(TPLECT-ND; Unit Price: 1.33; MFG_PN: TLP170AM(TPL,E
TP3 TP4 = CONN_TEST_POINT_S1751-46R: PCB TEST POINT CONNECT; MFG: Harwin Inc; Case/Package: S1751; MFG_PN: S1751-46R; Supplier 1: Digi-Key; Supplier Part Number 1: 952-1478-1-ND; Value: *; Unit Price: .28
U3 = OPAMP_TLV9351IDCKR: as U2 on sheet ArbPwrBoost_P2; Package/Case: SOT-353; Supplier 1: DigiKey; MFG_PN: TLV9351IDCKR; Unit Price: .49; Supplier Part Number 1: 296-TLV9351IDCKRCT-ND
U4 = IC_MCP45HV51-104E/ST: IC DGT POT 100KOHM 256TP 14TSSOP; MFG: Microchip; Case/Package: TSSOP-14; Supplier 1: DigiKey; Supplier Part Number 1: MCP45HV51-104E/ST-ND; Unit Price: 2.00; MFG_PN: MCP45HV51-104E/ST

## Sheet ArbPwrBoost_P4.SchDoc: =ProjectTitle
size B; Date: 05/12/25; Engineer: Hab Collector; Organization: Altium Limited; Address1: 3621 Gin Way; Address2: Snellville, GA 30039; DocumentNumber: IMR-005-SCH; Revision: 4; SheetNumber: 4; SheetTotal: 8
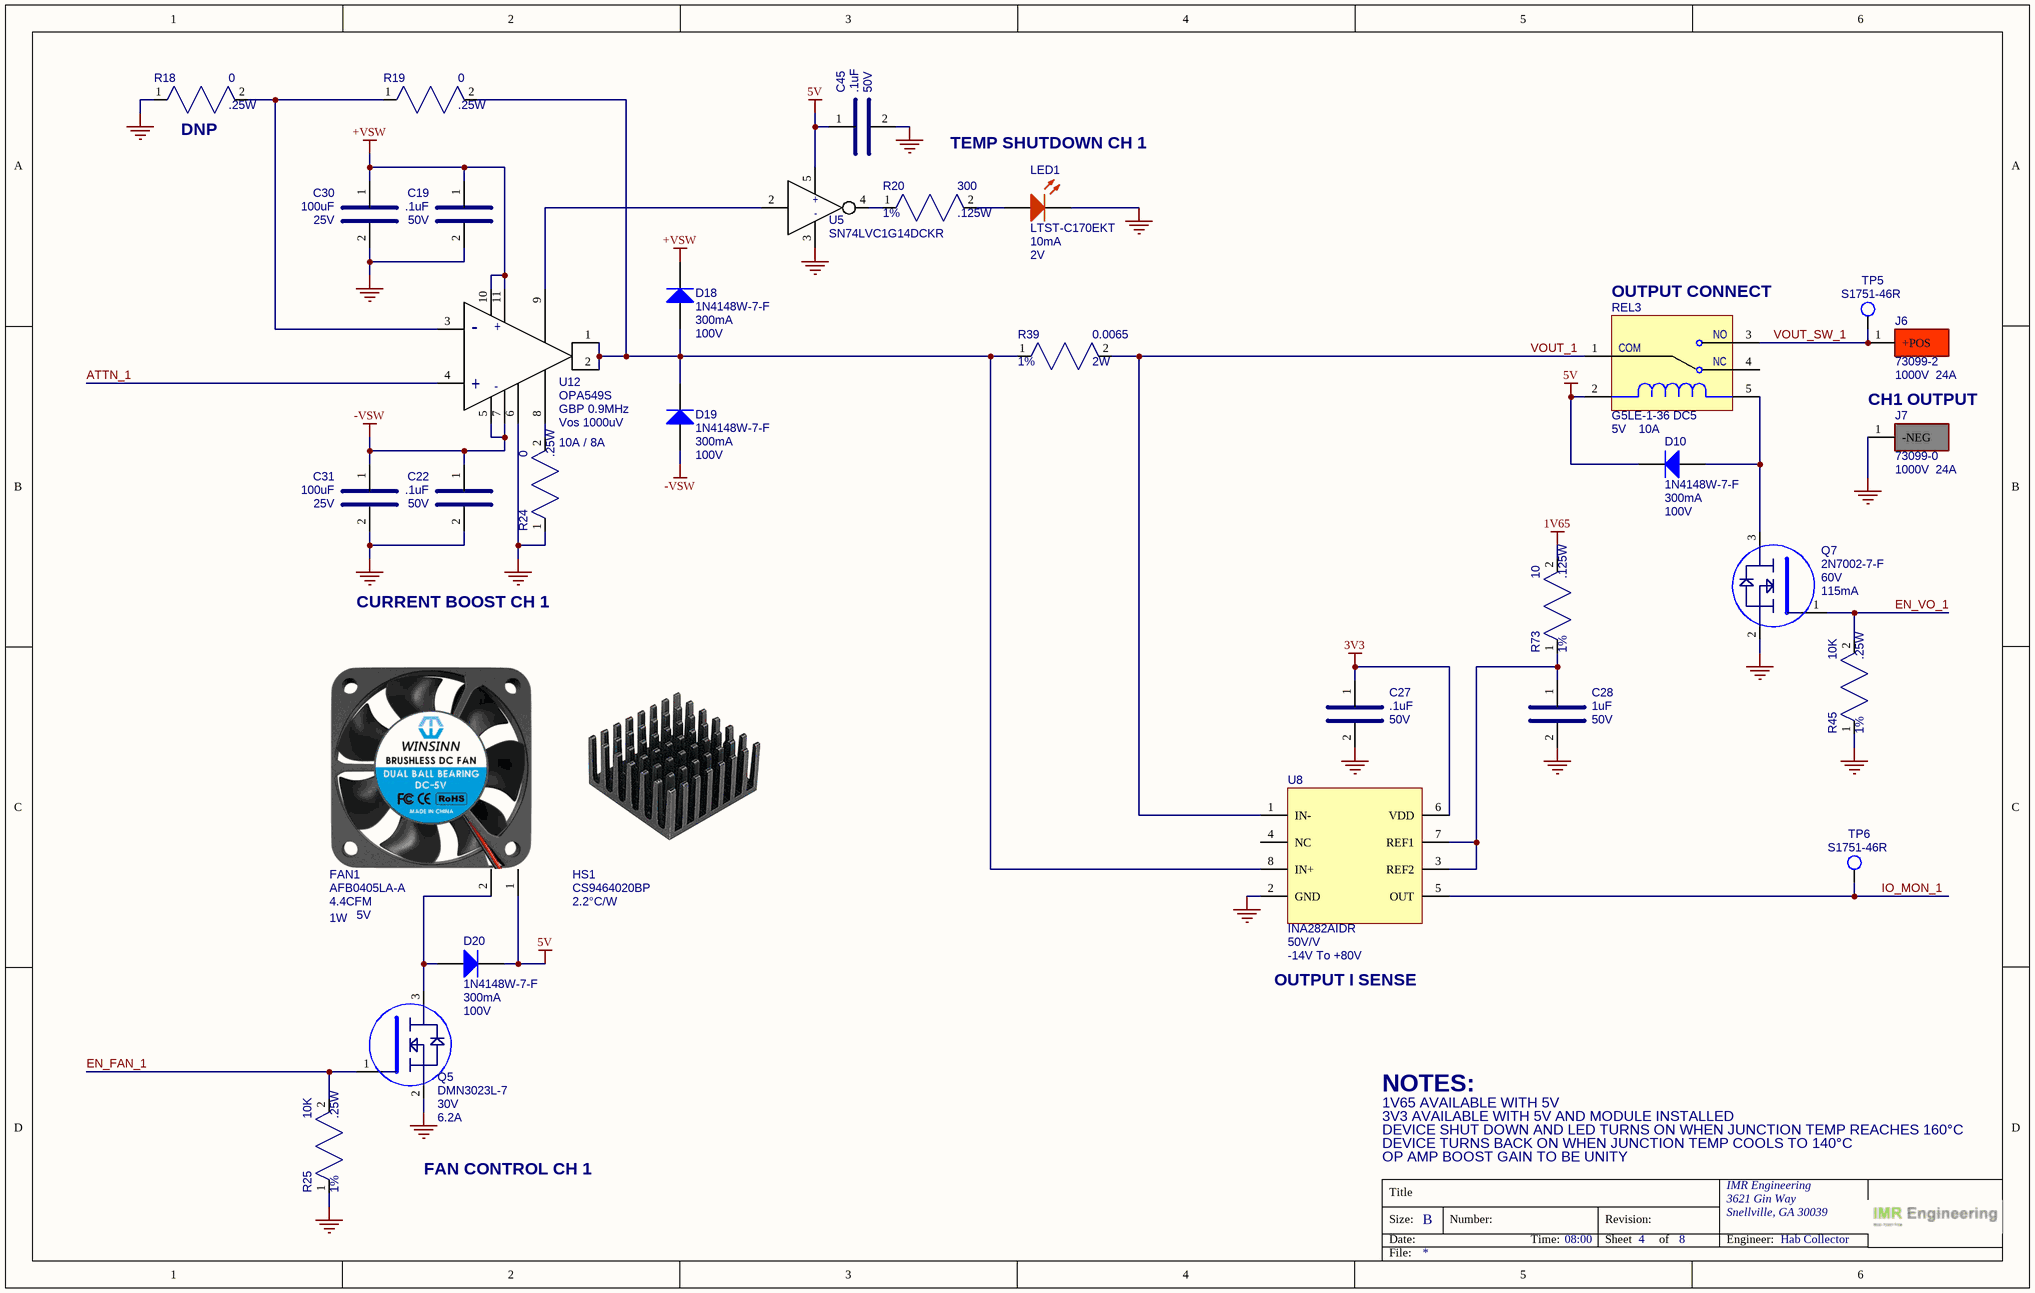
[diagram p3: ArbPwrBoost_P4.SchDoc]

### Parts
C19  value .1uF  Voltage: 50V  [CAP_0805]  (hidden comment: KGM21NR71H104KT)
C22  value .1uF  Voltage: 50V  [CAP_0805]  (hidden comment: KGM21NR71H104KT)
C27  value .1uF  Voltage: 50V  [CAP_0805]  (hidden comment: KGM21NR71H104KT)
C28  value 1uF  Voltage: 50V  [CAP_0805]  (hidden comment: 08055C105K4T2A)
C30  value 100uF  Voltage: 25V  [CAPC6153X670N]  (hidden comment: KCM55WC71E107MH13L)
C31  value 100uF  Voltage: 25V  [CAPC6153X670N]  (hidden comment: KCM55WC71E107MH13L)
C45  value .1uF  Voltage: 50V  [CAP_0805]  (hidden comment: KGM21NR71H104KT)
D10  value 100V  Current: 300mA  [SOD123]  (hidden comment: 1N4148W-7-F)
D18  value 100V  Current: 300mA  [SOD123]  (hidden comment: 1N4148W-7-F)
D19  value 100V  Current: 300mA  [SOD123]  (hidden comment: 1N4148W-7-F)
D20  value 100V  Current: 300mA  [SOD123]  (hidden comment: 1N4148W-7-F)
FAN1  Air Flow: 4.4CFM  Voltage: 5V  Power: 1W  [FAN_AFB0405LA-A]  (hidden comment: AFB0405LA-A)
HS1  Thermal Resistance: 2.2°C/W  [HEATSINK_CS9464020BP]  (hidden comment: CS9464020BP)
J6  value 1000V  Current: 24A  [Pomona_73099-2]  (hidden comment: 73099-2)
J7  value 1000V  Current: 24A  [Pomona_73099-0]  (hidden comment: 73099-0)
LED1  value 2V  Current: 10mA  [LED_0805]  (hidden comment: LTST-C170EKT)
Q5  value 30V  Current: 6.2A  [SOT-23]  (hidden comment: DMN3023L-7)
Q7  value 60V  Current: 115mA  [SOT-23]  (hidden comment: 2N7002-7-F)
R18  value 0  Power: .25W  [RES_0805]  (hidden comment: RC0805JR-070RL)
R19  value 0  Power: .25W  [RES_0805]  (hidden comment: RC0805JR-070RL)
R20  value 300  Power: .125W  Tolerance: 1%  [RES_0805]  (hidden comment: RC0805FR-07300RL)
R24  value 0  Power: .25W  [RES_0805]  (hidden comment: RC0805JR-070RL)
R25  value 10K  Power: .25W  Tolerance: 1%  [RES_0805]  (hidden comment: RC0805FR-7W10KL)
R39  value 0.0065  Tolerance: 1%  Power: 2W  [RES_2512]  (hidden comment: WSL25126L500FEA18)
R45  value 10K  Power: .25W  Tolerance: 1%  [RES_0805]  (hidden comment: RC0805FR-7W10KL)
R73  value 10  Power: .125W  Tolerance: 1%  [RES_0805]  (hidden comment: RC0805FR-1310RL)
REL3  value 5V  Current: 10A  [G5LE]  (hidden comment: G5LE-1-36 DC5)
TP5  S1751-46R  [HARWIN_S1751]
TP6  S1751-46R  [HARWIN_S1751]
U5  SN74LVC1G14DCKR  [SOT-353]
U8  value 50V/V  Common Mode: -14V To +80V  [SOIC-8_54]  (hidden comment: INA282AIDR)
U12  value GBP 0.9MHz  Vos: Vos 1000uV  Peak / Contineous Current: 10A / 8A  [POWER_PACKAGE_11]  (hidden comment: OPA549S)

### Nets
1V65: R73.2
3V3: C27.1 U8.6(VDD)
5V: C45.1 D10.2(K) D20.2(K) FAN1.1 REL3.2 U5.5
+VSW: C19.1 C30.1 D18.2(K) U12.10 U12.11
-VSW: C22.1 C31.1 D19.1(A) U12.5 U12.7
GND: C19.2 C22.2 C27.2 C28.2 C30.2 C31.2 C45.2 J7.1(-NEG) LED1.K Q5.2(E) Q7.2(E) R18.1 R24.1 R25.1 R45.1 U5.3 U8.2(GND) U12.6
ATTN_1: U12.4(+)
EN_FAN_1: Q5.1(B) R25.2
EN_VO_1: Q7.1(B) R45.2
IO_MON_1: TP6.1 U8.5(OUT)
VOUT_1: R39.2 REL3.1(COM) U8.1(IN-)
VOUT_SW_1: J6.1(+POS) REL3.3(NO) TP5.1
NetC28_1: C28.1 R73.1 U8.3(REF2) U8.7(REF1)
NetD10_1: D10.1(A) Q7.3(C) REL3.5
NetD18_1: D18.1(A) D19.2(K) R19.2 R39.1 U8.8(IN+) U12.1 U12.2
NetD20_1: D20.1(A) FAN1.2 Q5.3(C)
NetLED1_A: LED1.A R20.2
NetR18_2: R18.2 R19.1 U12.3(-)
NetR20_1: R20.1 U5.4(Y)
NetR24_2: R24.2 U12.8
NetU5_2: U5.2(A) U12.9

Not connected (* = marked no-connect by the designer): REL3 4(NC); U8 4(NC)

### Notes on the sheet
- (near R18) DNP
- TEMP SHUTDOWN CH 1
- (near REL3) OUTPUT CONNECT
- (near J7) CH1 OUTPUT
- CURRENT BOOST CH 1
- OUTPUT I SENSE
- NOTES:
- 1V65 AVAILABLE WITH 5V
- FAN CONTROL CH 1
- 3V3 AVAILABLE WITH 5V AND MODULE INSTALLED
- DEVICE SHUT DOWN AND LED TURNS ON WHEN JUNCTION TEMP REACHES 160°C
- DEVICE TURNS BACK ON WHEN JUNCTION TEMP COOLS TO 140°C
- OP AMP BOOST GAIN TO BE UNITY
- Title
- Size:
- Date:
- B
- Number:
- Time:
- Revision:
- Sheet
- of
- IMR Engineering
- Engineer:
- File:
- (in symbol IC_SN74LVC1G14DCKR) +; -

### Library data of the parts
C19 C22 C27 C45 = CAP_SMD_0.1UF_50V_0805: as C5 on sheet ArbPwrBoost_P2; Case/Package: 0805; MFG_PN: KGM21NR71H104KT; Supplier 1: DigiKey; Supplier Part Number 1: 478-KGM21NR71H104KTCT-ND; Unit Price: .1
C28 = CAP_SMD_1UF_50V_0805: CAP CER 1UF 50V X7R 0805; MFG: KYOCERA AVX; Case/Package: 0805; MFG_PN: 08055C105K4T2A; Supplier 1: DigiKey; Supplier Part Number 1: 478-KAM21KR71H105KUCT-ND; Unit Price: .27
C30 C31 = CAP_SMD_100UF_25V_SMD: CAP CER 100UF 25V X7S SMD; MFG: Murata Electronics; Case/Package: CAPC6153X670N; MFG_PN: KCM55WC71E107MH13L; Supplier 1: DigiKey; Supplier Part Number 1: 490-KCM55WC71E107MH13LCT-ND; Unit Price: 5.68
D10 D18-D20 = DIODE_1N4148W-7-F: as D2 on sheet ArbPwrBoost_P2; Case/Package: SOD-123; Supplier 1: DigiKey; Supplier Part Number 1: 1N4148W-FDICT-ND; Unit Price: .16; MFG_PN: 1N4148W-7-F
FAN1 = FAN_AFB0405LA-A: FAN AXIAL 40X10MM BALL 5VDC WIRE; MFG: Delta Electronicis; Case/Package: 40x40x10mm; Supplier 1: DigiKey; Supplier Part Number 1: 603-2014-ND; Unit Price: 7.31; MFG_PN: AFB0405LA-A
HS1 = HEATSINK_CS9464020BP: Heat Sink Aluminum Top Mount; MFG: Cooling Source; Case/Package: 40x40x20mm; Supplier 1: DigiKey; Supplier Part Number 1: 4165-CS9464020BP-ND; Unit Price: 3.41; MFG_PN: CS9464020BP
J6 = CONN_PANOMA_73099-2: as J1 on sheet ArbPwrBoost_P2; Case/Package: 73099-2; Supplier 1: DigiKey; Supplier Part Number 1: 501-73099-2-ND; Unit Price: 10.39; MFG_PN: 73099-2
J7 = CONN_PANOMA_73099-0: as J2 on sheet ArbPwrBoost_P2; Case/Package: 73099-0; Supplier 1: DigiKey; Supplier Part Number 1: 501-73099-0-ND; Unit Price: 10.39; MFG_PN: 73099-0
LED1 = LED_RED_LTST-C170EKT: LED RED CLEAR SMD; MFG: Diodes Inc; Case/Package: 0805; Supplier 1: DigiKey; Supplier Part Number 1: 160-1178-1-ND; Unit Price: .18; MFG_PN: LTST-C170EKT
Q5 = MOSFET_NCH_DMN3023L-7: MOSFET N-CH 30V 6.2A SOT23-3; MFG: Diodes Inc; Case/Package: SOT-23; Supplier 1: DigiKey; Supplier Part Number 1: DMN3023L-7DICT-ND; Unit Price: .48; MFG_PN: DMN3023L-7
Q7 = MOSFET_NCH_2N7002-7-F: as Q3 on sheet ArbPwrBoost_P2; Case/Package: SOT-23; Supplier 1: DigiKey; Supplier Part Number 1: 2N7002-FDICT-ND; Unit Price: .20; MFG_PN: 2N7002-7-F
R18 R19 R24 = RES_SMD_0_0805_1/8W_1%: RES SMD 0 OHM 1% 1/8W 0805; MFG: Yageo; Case/Package: 0805; MFG_PN: RC0805JR-070RL; Supplier 1: DigiKey; Supplier Part Number 1: 311-0.0ARCT-ND; Unit Price: .1; Tolerance: 1%
R20 = RES_SMD_300_0805_1/8W_1%: RES SMD 300 OHM 1% 1/8W 0805; MFG: Yageo; Case/Package: 0805; MFG_PN: RC0805FR-07300RL; Supplier 1: DigiKey; Supplier Part Number 1: 311-300CRCT-ND; Unit Price: .1
R25 R45 = RES_SMD_10K_0805_1/4W_1%: RES SMD 10K OHM 1% 1/4W 0805; MFG: Yageo; Case/Package: 0805; MFG_PN: RC0805FR-7W10KL; Supplier 1: DigiKey; Supplier Part Number 1: 13-RC0805FR-7W10KLCT-ND; Unit Price: .10
R39 = RES_SMD_0.0065_2512_2W_1%: RES SMD 0.0065 OHM 1% 2W 2512; MFG: Vishay Dale; Case/Package: 2512; MFG_PN: WSL25126L500FEA18; Supplier 1: DigiKey; Supplier Part Number 1: 541-WSL25126L500FEA18CT-ND; Unit Price: 1.76
R73 = RES_SMD_10_0805_1/8W_1%: RES SMD 10 OHM 1% 1/8W 0805; MFG: Yageo; Case/Package: 0805; MFG_PN: RC0805FR-1310RL; Supplier 1: DigiKey; Supplier Part Number 1: 13-RC0805FR-1310RLCT-ND; Unit Price: .1
REL3 = RELAY_G5LE-1-36 DC5: RELAY GEN PURPOSE SPDT 10A 5V; MFG: Omron; Case/Package: G5LE; Supplier 1: DigiKey; Supplier Part Number 1: G5LE-1-36DC5-ND; Unit Price: 1.24; Supplier: DigiKey; Manufacturer: Omron; MFG_PN: G5LE-1-36 DC5
TP5 TP6 = CONN_TEST_POINT_S1751-46R: PCB TEST POINT CONNECT; MFG: Harwin Inc; Case/Package: S1751; MFG_PN: S1751-46R; Supplier 1: Digi-Key; Supplier Part Number 1: 952-1478-1-ND; Value: *; Unit Price: .28
U5 = IC_SN74LVC1G14DCKR: IC INVERT SCHMITT 1CH 1IN SC70-5; MFG: Texas Instruments; Unit Price: .10; Package/Case: SC70-5; Supplier 1: DigiKey; Supplier Part Number 1: 296-11608-1-ND; MFG_PN: SN74LVC1G14DCKR
U8 = IC_INA282AIDR: IC CURRENT SENSE 0.4% 50V/V SOIC-8; MFG: Texas Instruments; Case/Package: SOIC-8; Supplier 1: DigiKey; Supplier Part Number 1: 296-27820-1-ND; Unit Price: 4.13; MFG_PN: INA282AIDR
U12 = OPAMP_OPA549S: IC OPAMP POWER 1 CIRC 11PWRPACK; MFG: Texas Instruments; Unit Price: 26.94; Package/Case: Power Package-11; Supplier 1: DigiKey; Supplier Part Number 1: OPA549S-ND; MFG_PN: OPA549S

## Sheet ArbPwrBoost_P5.SchDoc: =ProjectTitle
size B; Date: 05/12/25; Engineer: Hab Collector; Organization: Altium Limited; Address1: 3621 Gin Way; Address2: Snellville, GA 30039; DocumentNumber: IMR-005-SCH; Revision: 4; SheetNumber: 5; SheetTotal: 8
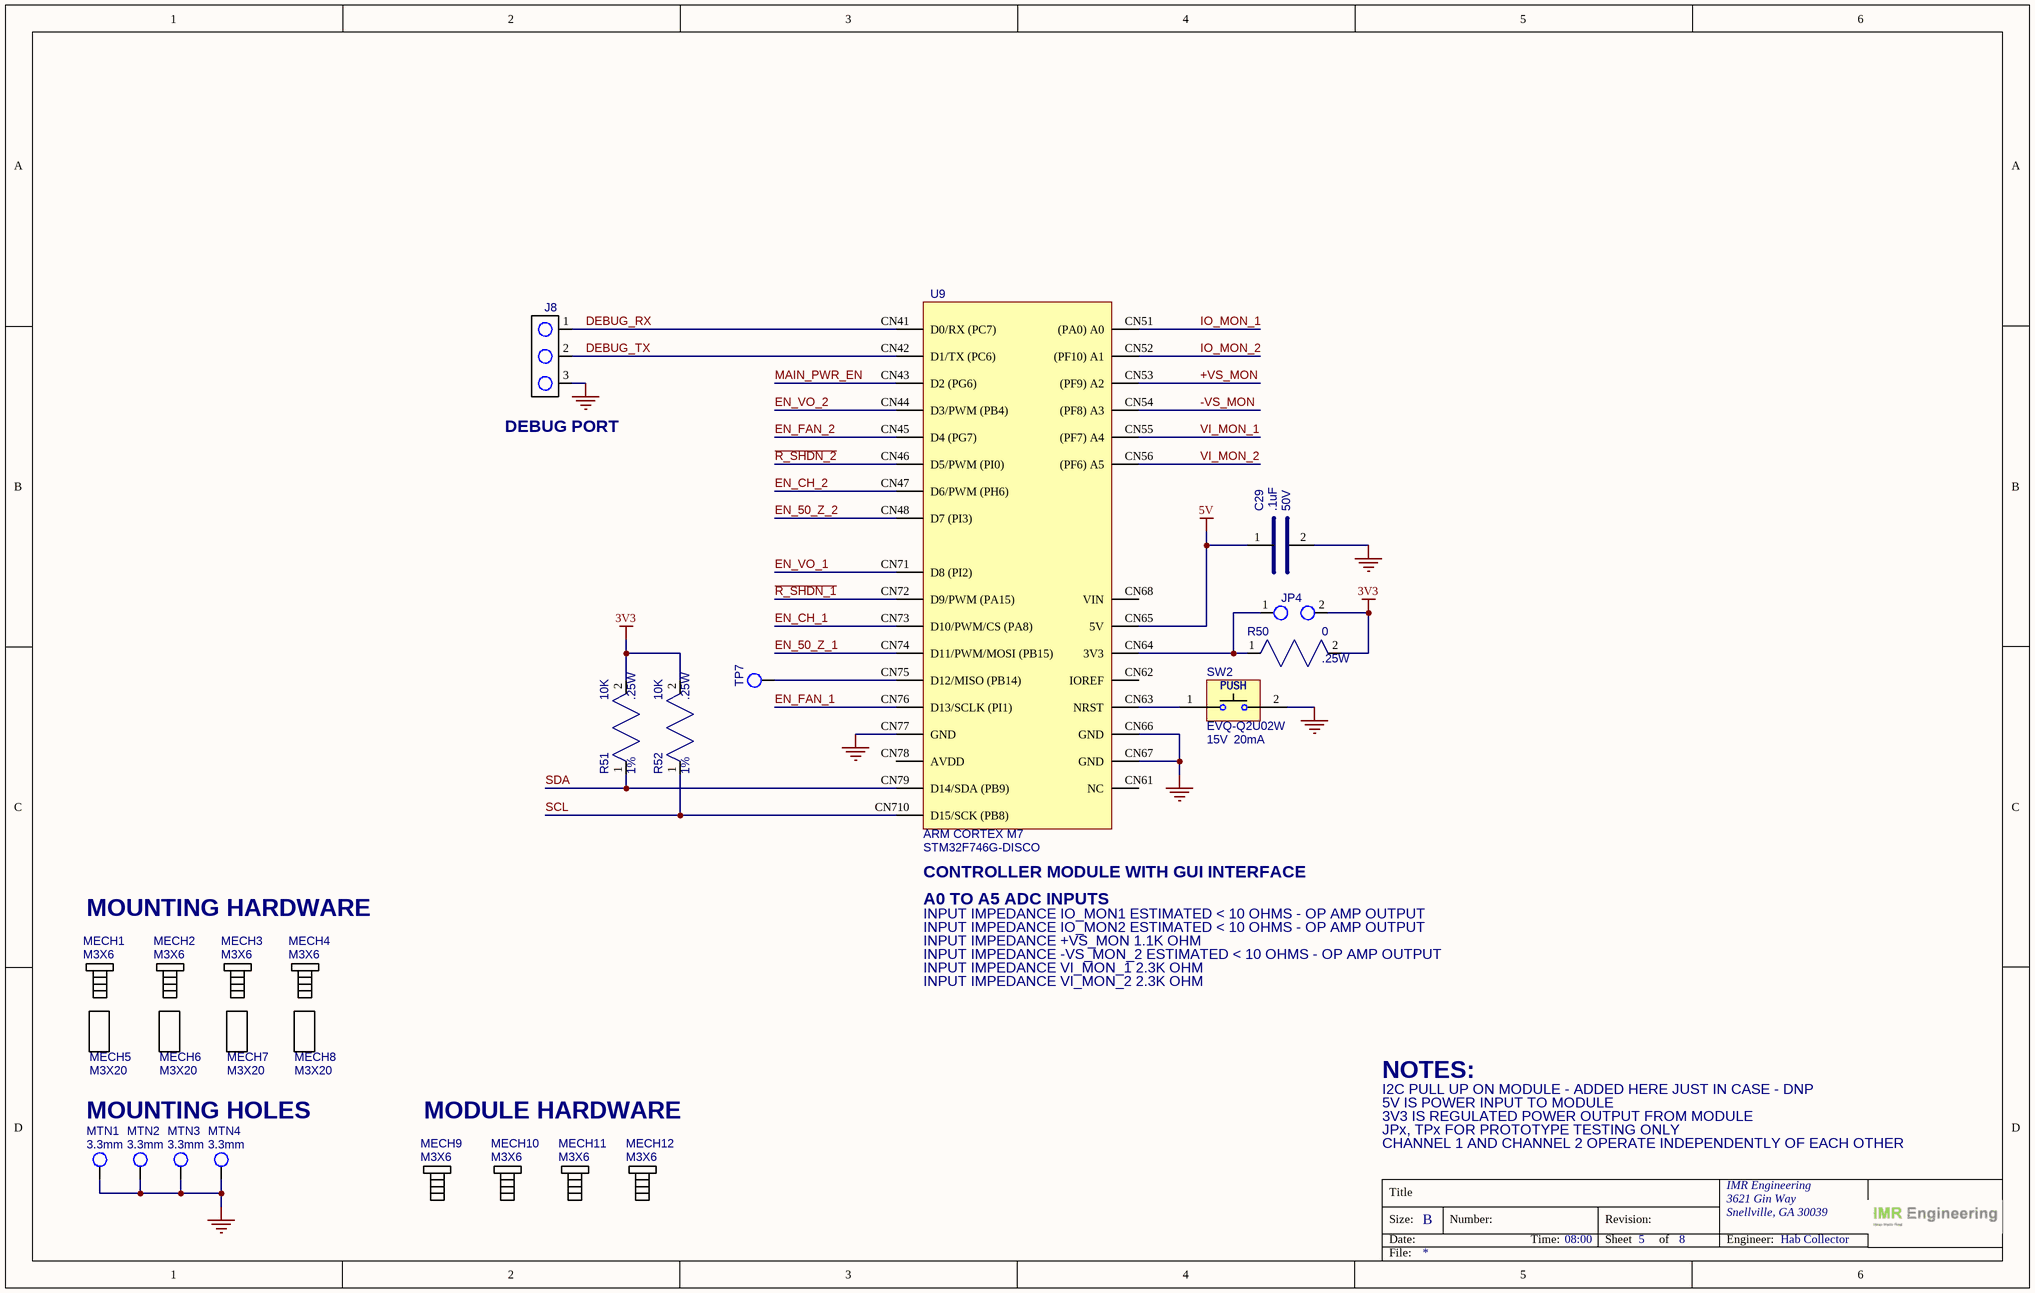
[diagram p4: ArbPwrBoost_P5.SchDoc]

### Parts
C29  value .1uF  Voltage: 50V  [CAP_0805]  (hidden comment: KGM21NR71H104KT)
J8  PREC003SFAN-RC  [HDR_1X3_100MILL]  (value not drawn)
JP4  PREC002SFAN-RC  [HDR_1X2_100MILL]  (value not drawn)
MECH1  Size: M3X6  [MECHANICAL_SCREW_M3X6]  (hidden comment: RM3X6MM 2701)
MECH2  Size: M3X6  [MECHANICAL_SCREW_M3X6]  (hidden comment: RM3X6MM 2701)
MECH3  Size: M3X6  [MECHANICAL_SCREW_M3X6]  (hidden comment: RM3X6MM 2701)
MECH4  Size: M3X6  [MECHANICAL_SCREW_M3X6]  (hidden comment: RM3X6MM 2701)
MECH5  Size: M3X20  [MECHANICAL_SPACER_F_F_M3X20]  (hidden comment: 24407)
MECH6  Size: M3X20  [MECHANICAL_SPACER_F_F_M3X20]  (hidden comment: 24407)
MECH7  Size: M3X20  [MECHANICAL_SPACER_F_F_M3X20]  (hidden comment: 24407)
MECH8  Size: M3X20  [MECHANICAL_SPACER_F_F_M3X20]  (hidden comment: 24407)
MECH9  Size: M3X6  [MECHANICAL_SCREW_M3X6]  (hidden comment: RM3X6MM 2701)
MECH10  Size: M3X6  [MECHANICAL_SCREW_M3X6]  (hidden comment: RM3X6MM 2701)
MECH11  Size: M3X6  [MECHANICAL_SCREW_M3X6]  (hidden comment: RM3X6MM 2701)
MECH12  Size: M3X6  [MECHANICAL_SCREW_M3X6]  (hidden comment: RM3X6MM 2701)
MTN1  Hole Size: 3.3mm  [PMG_MT_HOLE_3.3MM]  (no BOM)
MTN2  Hole Size: 3.3mm  [PMG_MT_HOLE_3.3MM]  (no BOM)
MTN3  Hole Size: 3.3mm  [PMG_MT_HOLE_3.3MM]  (no BOM)
MTN4  Hole Size: 3.3mm  [PMG_MT_HOLE_3.3MM]  (no BOM)
R50  value 0  Power: .25W  [RES_0805]  (hidden comment: RC0805JR-070RL)
R51  value 10K  Power: .25W  Tolerance: 1%  [RES_0805]  (hidden comment: RC0805FR-7W10KL)
R52  value 10K  Power: .25W  Tolerance: 1%  [RES_0805]  (hidden comment: RC0805FR-7W10KL)
SW2  value 15V  Current: 20mA  [PANASONIC_EVQ-Q2U02W]  (hidden comment: EVQ-Q2U02W)
TP7  (no value)  [TEST_POINT_20MIL_TH]  (no BOM)
U9  value ARM CORTEX M7  [STM32F746G-DISCO]  (hidden comment: STM32F746G-DISCO)

### Nets
3V3: JP4.2 R50.2 R51.2 R52.2
5V: C29.1 U9.CN65(5V)
GND: C29.2 J8.3 MTN1.1 MTN2.1 MTN3.1 MTN4.1 SW2.2(B') U9.CN66(GND) U9.CN67(GND) U9.CN77(GND)
+VS_MON: U9.CN53((PF9)_A2)
-VS_MON: U9.CN54((PF8)_A3)
~{R_SHDN_1}: U9.CN72(D9/PWM_(PA15))
~{R_SHDN_2}: U9.CN46(D5/PWM_(PI0))
DEBUG_RX: J8.1 U9.CN41(D0/RX_(PC7))
DEBUG_TX: J8.2 U9.CN42(D1/TX_(PC6))
EN_50_Z_1: U9.CN74(D11/PWM/MOSI_(PB15))
EN_50_Z_2: U9.CN48(D7_(PI3))
EN_CH_1: U9.CN73(D10/PWM/CS_(PA8))
EN_CH_2: U9.CN47(D6/PWM_(PH6))
EN_FAN_1: U9.CN76(D13/SCLK_(PI1))
EN_FAN_2: U9.CN45(D4_(PG7))
EN_VO_1: U9.CN71(D8_(PI2))
EN_VO_2: U9.CN44(D3/PWM_(PB4))
IO_MON_1: U9.CN51((PA0)_A0)
IO_MON_2: U9.CN52((PF10)_A1)
MAIN_PWR_EN: U9.CN43(D2_(PG6))
SCL: R52.1 U9.CN710(D15/SCK_(PB8))
SDA: R51.1 U9.CN79(D14/SDA_(PB9))
VI_MON_1: U9.CN55((PF7)_A4)
VI_MON_2: U9.CN56((PF6)_A5)
NetJP4_1: JP4.1 R50.1 U9.CN64(3V3)
NetSW2_1: SW2.1(B) U9.CN63(NRST)
NetTP7_1: TP7.1 U9.CN75(D12/MISO_(PB14))

Not connected (* = marked no-connect by the designer): U9 CN61(NC) CN62(IOREF) CN68(VIN) CN78(AVDD)

### Notes on the sheet
- (near J8) DEBUG PORT
- (near U9) CONTROLLER MODULE WITH GUI INTERFACE
- A0 TO A5 ADC INPUTS
- MOUNTING HARDWARE
- INPUT IMPEDANCE IO_MON1 ESTIMATED < 10 OHMS - OP AMP OUTPUT
- INPUT IMPEDANCE IO_MON2 ESTIMATED < 10 OHMS - OP AMP OUTPUT
- INPUT IMPEDANCE +VS_MON 1.1K OHM
- INPUT IMPEDANCE -VS_MON_2 ESTIMATED < 10 OHMS - OP AMP OUTPUT
- INPUT IMPEDANCE VI_MON_1 2.3K OHM
- INPUT IMPEDANCE VI_MON_2 2.3K OHM
- I2C PULL UP ON MODULE - ADDED HERE JUST IN CASE - DNP
- NOTES:
- 5V IS POWER INPUT TO MODULE
- MOUNTING HOLES
- MODULE HARDWARE
- 3V3 IS REGULATED POWER OUTPUT FROM MODULE
- CHANNEL 1 AND CHANNEL 2 OPERATE INDEPENDENTLY OF EACH OTHER
- JPx, TPx FOR PROTOTYPE TESTING ONLY
- Title
- Size:
- Date:
- B
- Number:
- Time:
- Revision:
- Sheet
- of
- IMR Engineering
- Engineer:
- File:
- (in symbol SWITCH_EVQ-Q2U02W) PUSH

### Library data of the parts
C29 = CAP_SMD_0.1UF_50V_0805: as C5 on sheet ArbPwrBoost_P2; Case/Package: 0805; MFG_PN: KGM21NR71H104KT; Supplier 1: DigiKey; Supplier Part Number 1: 478-KGM21NR71H104KTCT-ND; Unit Price: .1
J8 = CONN_HEADER_3P_100MIL_VERT: CONN HEADER VERT 3POS 2.54MM; MFG: Sullins Connector Solutions; Case/Package: 2P_2.54MM; MFG_PN: PREC003SFAN-RC; Supplier 1: Digi-Key; Supplier Part Number 1: S1212EC-03-ND; Value: *; Unit Price: .07
JP4 = CONN_JUMPER_2P_100MIL_VERT: as JP1 on sheet ArbPwrBoost_P2; Case/Package: 2P_2.54MM; MFG_PN: PREC002SFAN-RC; Supplier 1: Digi-Key; Supplier Part Number 1: S1212EC-02-ND; Value: *; Unit Price: .07
MECH1-MECH4 MECH9-MECH12 = MECHANICAL_SCREW_M3X6_PAN_HEAD: SCREW M3X6 PAN HEAD SS; MFG: APM Hexseal; Case/Package: SCREW_M3X6; Supplier 1: DigiKey; Supplier Part Number 1: 335-1156-ND; Unit Price: .58; MFG_PN: RM3X6MM 2701
MECH5-MECH8 = MECHANICAL_STANDOFF_M3X20: HEX STANDOFF M3 BRASS 20MM; MFG: Keystone Electronics; Case/Package: STANDOFF_M3X20; Supplier 1: DigiKey; Supplier Part Number 1: 36-24407-ND; Unit Price: 1.36; MFG_PN: 24407
MTN1-MTN4 = MTN_HOLE_3.3MM: MOUNTING HOLE 3.3MM
R50 = RES_SMD_0_0805_1/8W_1%: RES SMD 0 OHM 1% 1/8W 0805; MFG: Yageo; Case/Package: 0805; MFG_PN: RC0805JR-070RL; Supplier 1: DigiKey; Supplier Part Number 1: 311-0.0ARCT-ND; Unit Price: .1; Tolerance: 1%
R51 R52 = RES_SMD_10K_0805_1/4W_1%: RES SMD 10K OHM 1% 1/4W 0805; MFG: Yageo; Case/Package: 0805; MFG_PN: RC0805FR-7W10KL; Supplier 1: DigiKey; Supplier Part Number 1: 13-RC0805FR-7W10KLCT-ND; Unit Price: .10
SW2 = SWITCH_EVQ-Q2U02W: SWITCH TACTILE SPST-NO 0.02A 15V; MFG: American Zettler; Case/Package: EVQQ2; Supplier 1: DigiKey; Supplier Part Number 1: P12954SCT-ND; Unit Price: .25; MFG_PN: EVQ-Q2U02W
TP7 = CONN_TEST_POINT_TH_PAD_20MIL: TEST POINT TH 20MIL HOLE
U9 = MODULE_STM32F746G-DISCO: DISCOVERY STM32 F7 EVAL BRD; MFG: ST Microlectronics; Current: 2A; Case/Package: STM32F746G-DISCO; Supplier 1: DigiKey; Supplier Part Number 1: 497-15680-5-ND; Unit Price: 57.50; MFG_PN: STM32F746G-DISCO

## Sheet ArbPwrBoost_P6.SchDoc: =ProjectTitle
size B; Date: 05/12/25; Engineer: Hab Collector; Organization: Altium Limited; Address1: 3621 Gin Way; Address2: Snellville, GA 30039; DocumentNumber: IMR-005-SCH; Revision: 4; SheetNumber: 6; SheetTotal: 8
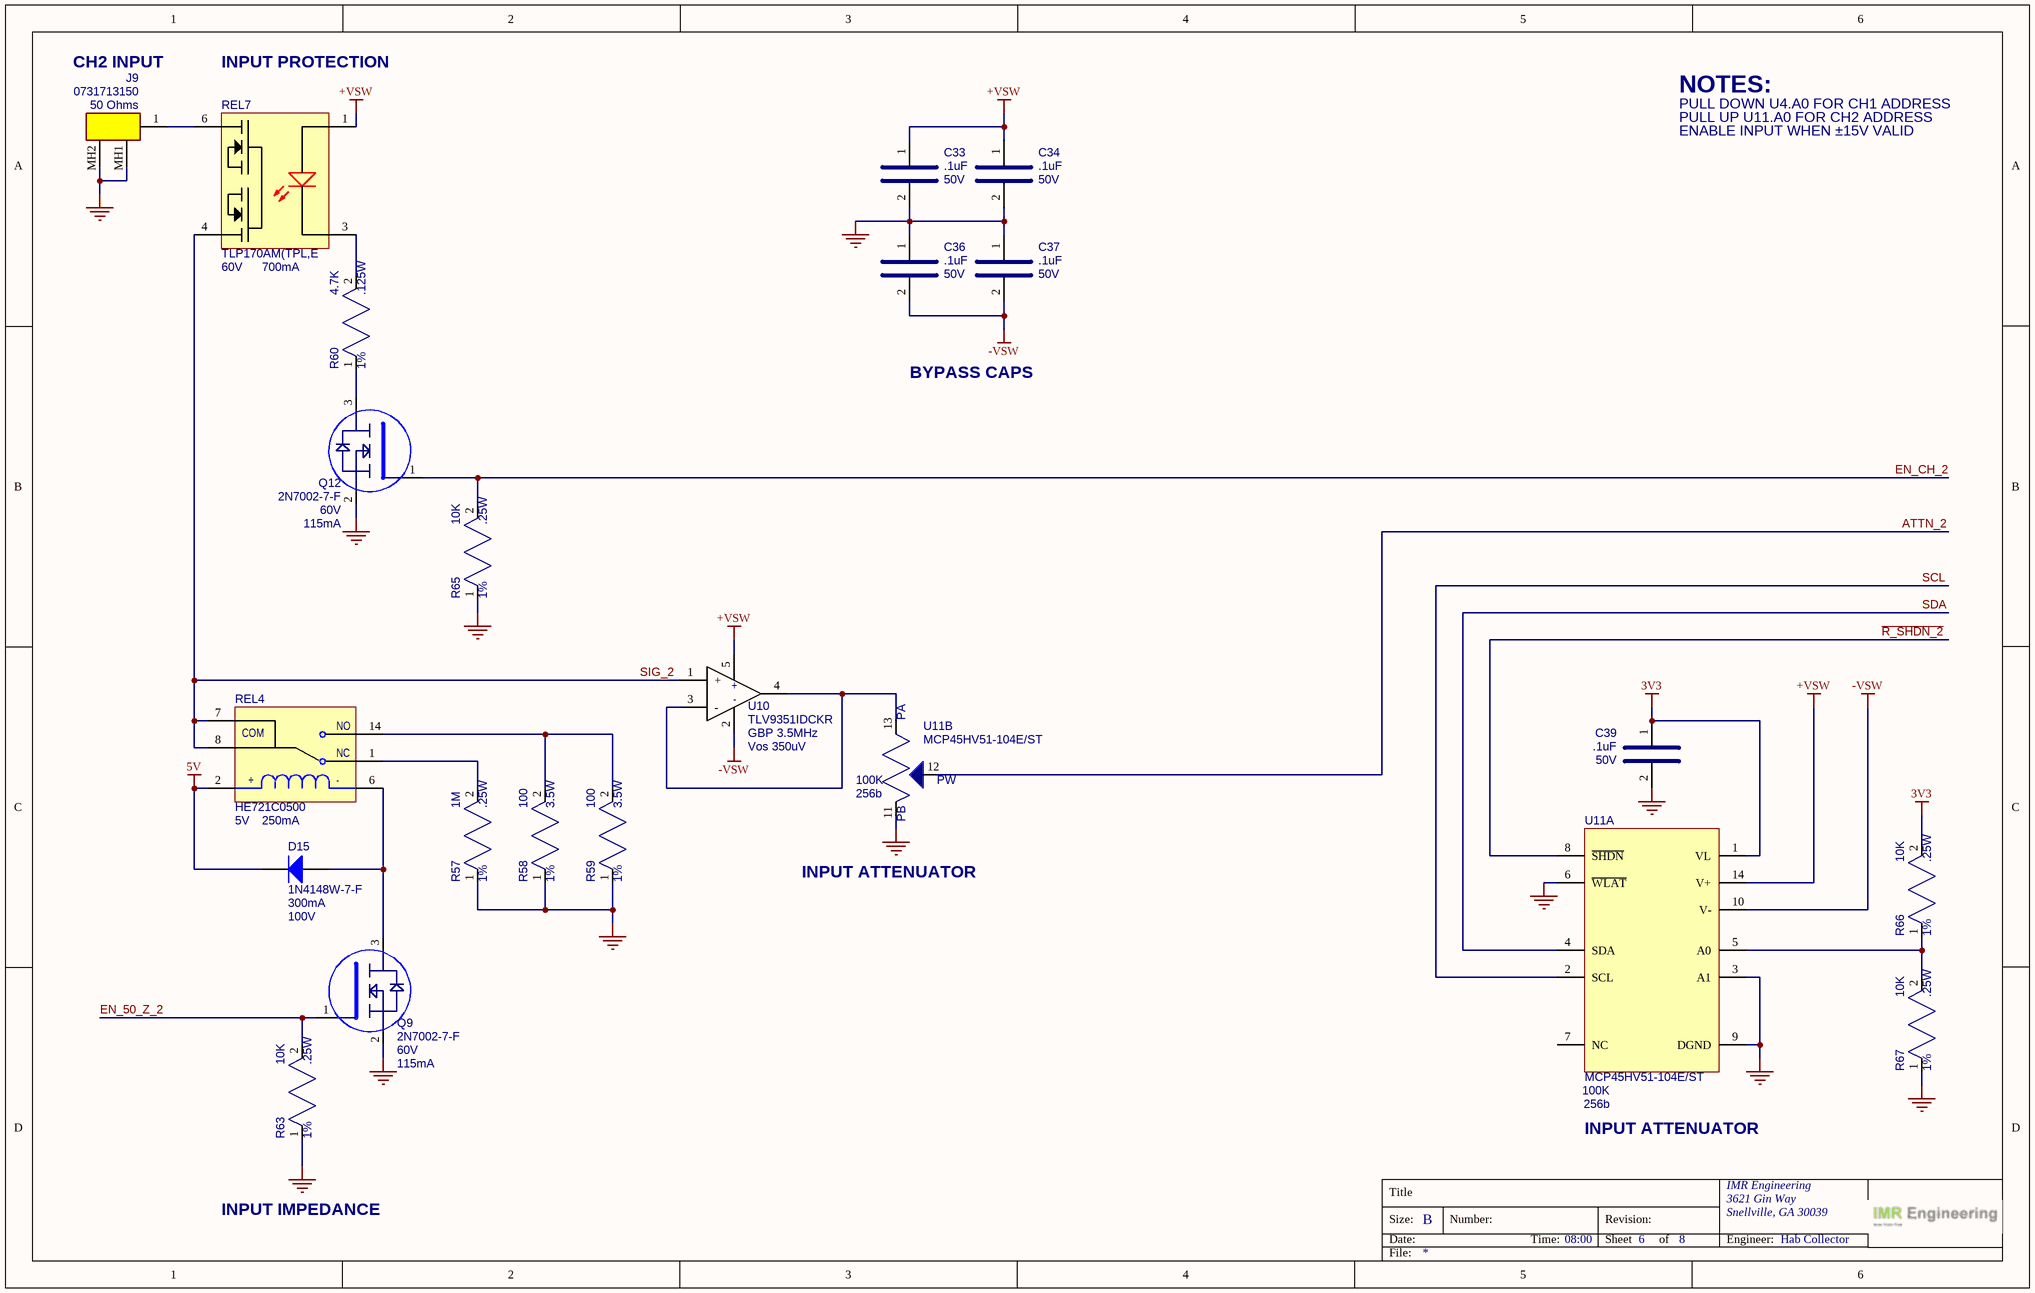
[diagram p5: ArbPwrBoost_P6.SchDoc]

### Parts
C33  value .1uF  Voltage: 50V  [CAP_0805]  (hidden comment: KGM21NR71H104KT)
C34  value .1uF  Voltage: 50V  [CAP_0805]  (hidden comment: KGM21NR71H104KT)
C36  value .1uF  Voltage: 50V  [CAP_0805]  (hidden comment: KGM21NR71H104KT)
C37  value .1uF  Voltage: 50V  [CAP_0805]  (hidden comment: KGM21NR71H104KT)
C39  value .1uF  Voltage: 50V  [CAP_0805]  (hidden comment: KGM21NR71H104KT)
D15  value 100V  Current: 300mA  [SOD123]  (hidden comment: 1N4148W-7-F)
J9  value 50 Ohms  [731713150]  (hidden comment: 0731713150)
Q9  value 60V  Current: 115mA  [SOT-23]  (hidden comment: 2N7002-7-F)
Q12  value 60V  Current: 115mA  [SOT-23]  (hidden comment: 2N7002-7-F)
R57  value 1M  Power: .25W  Tolerance: 1%  [RES_0805]  (hidden comment: RC0805FR-7W1ML)
R58  value 100  Power: 3.5W  Tolerance: 1%  [RES_2512]  (hidden comment: ALN2512F100RE-1)
R59  value 100  Power: 3.5W  Tolerance: 1%  [RES_2512]  (hidden comment: ALN2512F100RE-1)
R60  value 4.7K  Power: .125W  Tolerance: 1%  [RES_0805]  (hidden comment: RC0805FR-134K7L)
R63  value 10K  Power: .25W  Tolerance: 1%  [RES_0805]  (hidden comment: RC0805FR-7W10KL)
R65  value 10K  Power: .25W  Tolerance: 1%  [RES_0805]  (hidden comment: RC0805FR-7W10KL)
R66  value 10K  Power: .25W  Tolerance: 1%  [RES_0805]  (hidden comment: RC0805FR-7W10KL)
R67  value 10K  Power: .25W  Tolerance: 1%  [RES_0805]  (hidden comment: RC0805FR-7W10KL)
REL4  value 5V  Current: 250mA  [HE700]  (hidden comment: HE721C0500)
REL7  value 60V  Current: 700mA  [SOP-6]  (hidden comment: TLP170AM(TPL,E)
U10  value GBP 3.5MHz  Vos: Vos 350uV  [SOT-353]  (hidden comment: TLV9351IDCKR)
U11  value 100K  TAP: 256b  [TSSOP-14]  (hidden comment: MCP45HV51-104E/ST)  (parts A,B of 2)

### Nets
3V3: C39.1 R66.2 U11.1(VL)
5V: D15.2(K) REL4.2
+VSW: C33.1 C34.1 REL7.1 U10.5 U11.14(V+)
-VSW: C36.2 C37.2 U10.2 U11.10(V-)
GND: C33.2 C34.2 C36.1 C37.1 C39.2 J9.MH1 J9.MH2 Q9.2(E) Q12.2(E) R57.1 R58.1 R59.1 R63.1 R65.1 R67.1 U11.3(A1) U11.6(~{WLAT}) U11.9(DGND) U11.11(PB0)
~{R_SHDN_2}: U11.8(~{SHDN})
ATTN_2: U11.12(PW0)
EN_50_Z_2: Q9.1(B) R63.2
EN_CH_2: Q12.1(B) R65.2
SCL: U11.2(SCL)
SDA: U11.4(SDA)
SIG_2: REL4.7(COM) REL4.8(COM) REL7.4 U10.1(+)
NetD15_1: D15.1(A) Q9.3(C) REL4.6
NetJ9_1: J9.1 REL7.6
NetQ12_3: Q12.3(C) R60.1
NetR57_2: R57.2 REL4.1(NC)
NetR58_2: R58.2 R59.2 REL4.14(NO)
NetR60_2: R60.2 REL7.3
NetR66_1: R66.1 R67.2 U11.5(A0)
NetU10_3: U10.3(-) U10.4 U11.13(PA)

Not connected (* = marked no-connect by the designer): U11 7(NC)

### Notes on the sheet
- CH2 INPUT
- INPUT PROTECTION
- NOTES:
- PULL DOWN U4.A0 FOR CH1 ADDRESS
- PULL UP U11.A0 FOR CH2 ADDRESS
- ENABLE INPUT WHEN ±15V VALID
- BYPASS CAPS
- INPUT ATTENUATOR
- INPUT IMPEDANCE
- Title
- Size:
- Date:
- B
- Number:
- Time:
- Revision:
- Sheet
- of
- IMR Engineering
- Engineer:
- File:
- (in symbol IC_MCP45HV51-104E/ST, part B) PW; PB
- (in symbol RELAY_HE721C0500) +; -

### Library data of the parts
C33 C34 C36 C37 C39 = CAP_SMD_0.1UF_50V_0805: as C5 on sheet ArbPwrBoost_P2; Case/Package: 0805; MFG_PN: KGM21NR71H104KT; Supplier 1: DigiKey; Supplier Part Number 1: 478-KGM21NR71H104KTCT-ND; Unit Price: .1
D15 = DIODE_1N4148W-7-F: as D2 on sheet ArbPwrBoost_P2; Case/Package: SOD-123; Supplier 1: DigiKey; Supplier Part Number 1: 1N4148W-FDICT-ND; Unit Price: .16; MFG_PN: 1N4148W-7-F
J9 = CONN_MOLEX_0731713150: CONN BNC RCPT R/A 50 OHM PCB; MFG: Molex; Case/Package: 73099-2; Supplier 1: DigiKey; Supplier Part Number 1: WM20430-ND; Unit Price: 1.40; MFG_PN: 0731713150
Q9 Q12 = MOSFET_NCH_2N7002-7-F: as Q3 on sheet ArbPwrBoost_P2; Case/Package: SOT-23; Supplier 1: DigiKey; Supplier Part Number 1: 2N7002-FDICT-ND; Unit Price: .20; MFG_PN: 2N7002-7-F
R57 = RES_SMD_1M_0805_1/4W_1%: RES SMD 1K OHM 1% 1/4W 0805; MFG: Yageo; Case/Package: 0805; MFG_PN: RC0805FR-7W1ML; Supplier 1: DigiKey; Supplier Part Number 1: 13-RC0805FR-7W1MLCT-ND; Unit Price: .10
R58 R59 = RES_SMD_100_0805_3.5W_1%: as R22 on sheet ArbPwrBoost_P3; Case/Package: 2512; MFG_PN: ALN2512F100RE-1; Supplier 1: DigiKey; Supplier Part Number 1: 273-ALN2512F100RE-1CT-ND; Unit Price: 1.50
R60 = RES_SMD_4.7K_0805_1/8W_1%: as R70 on sheet ArbPwrBoost_P3; Case/Package: 0805; MFG_PN: RC0805FR-134K7L; Supplier 1: DigiKey; Supplier Part Number 1: 13-RC0805FR-134K7LCT-ND; Unit Price: .1
R63 R65-R67 = RES_SMD_10K_0805_1/4W_1%: RES SMD 10K OHM 1% 1/4W 0805; MFG: Yageo; Case/Package: 0805; MFG_PN: RC0805FR-7W10KL; Supplier 1: DigiKey; Supplier Part Number 1: 13-RC0805FR-7W10KLCT-ND; Unit Price: .10
REL4 = RELAY_HE721C0500: as REL2 on sheet ArbPwrBoost_P3; Case/Package: HE700; Supplier 1: DigiKey; Supplier Part Number 1: HE112-ND; Unit Price: 3.77; MFG_PN: HE721C0500
REL7 = RELAY_TLP170AM(TPL,E: as REL6 on sheet ArbPwrBoost_P3; Case/Package: SOP-6; Supplier 1: DigiKey; Supplier Part Number 1: 264-TLP170AM(TPLECT-ND; Unit Price: 1.33; MFG_PN: TLP170AM(TPL,E
U10 = OPAMP_TLV9351IDCKR: as U2 on sheet ArbPwrBoost_P2; Package/Case: SOT-353; Supplier 1: DigiKey; MFG_PN: TLV9351IDCKR; Unit Price: .49; Supplier Part Number 1: 296-TLV9351IDCKRCT-ND
U11 = IC_MCP45HV51-104E/ST: as U4 on sheet ArbPwrBoost_P3; Case/Package: TSSOP-14; Supplier 1: DigiKey; Supplier Part Number 1: MCP45HV51-104E/ST-ND; Unit Price: 2.00; MFG_PN: MCP45HV51-104E/ST

## Sheet ArbPwrBoost_P7.SchDoc: =ProjectTitle
size B; Date: 05/12/25; Engineer: Hab Collector; Organization: Altium Limited; Address1: 3621 Gin Way; Address2: Snellville, GA 30039; DocumentNumber: IMR-005-SCH; Revision: 4; SheetNumber: 7; SheetTotal: 8
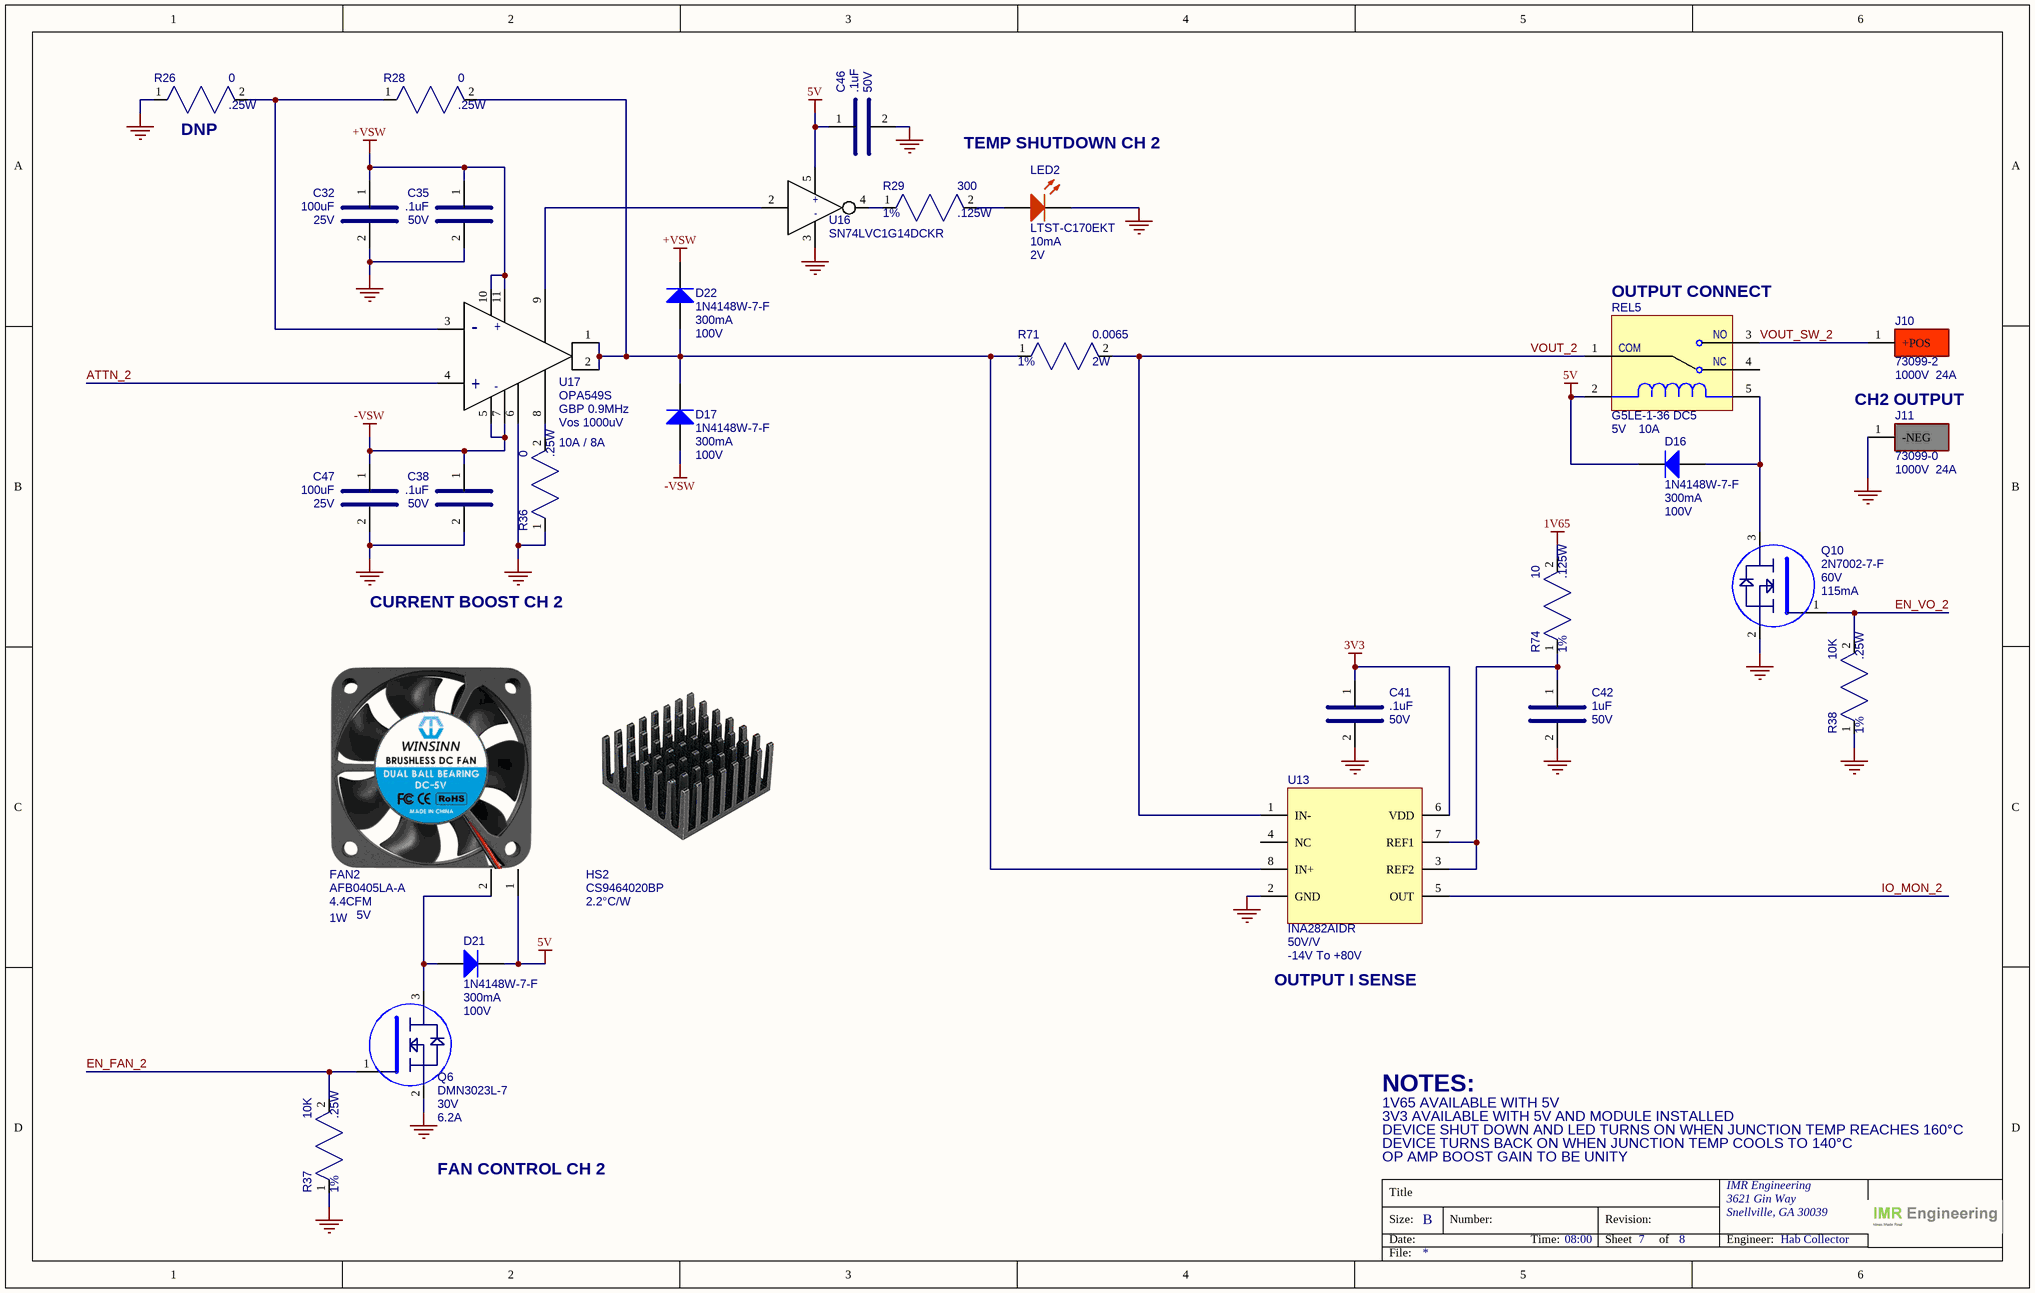
[diagram p6: ArbPwrBoost_P7.SchDoc]

### Parts
C32  value 100uF  Voltage: 25V  [CAPC6153X670N]  (hidden comment: KCM55WC71E107MH13L)
C35  value .1uF  Voltage: 50V  [CAP_0805]  (hidden comment: KGM21NR71H104KT)
C38  value .1uF  Voltage: 50V  [CAP_0805]  (hidden comment: KGM21NR71H104KT)
C41  value .1uF  Voltage: 50V  [CAP_0805]  (hidden comment: KGM21NR71H104KT)
C42  value 1uF  Voltage: 50V  [CAP_0805]  (hidden comment: 08055C105K4T2A)
C46  value .1uF  Voltage: 50V  [CAP_0805]  (hidden comment: KGM21NR71H104KT)
C47  value 100uF  Voltage: 25V  [CAPC6153X670N]  (hidden comment: KCM55WC71E107MH13L)
D16  value 100V  Current: 300mA  [SOD123]  (hidden comment: 1N4148W-7-F)
D17  value 100V  Current: 300mA  [SOD123]  (hidden comment: 1N4148W-7-F)
D21  value 100V  Current: 300mA  [SOD123]  (hidden comment: 1N4148W-7-F)
D22  value 100V  Current: 300mA  [SOD123]  (hidden comment: 1N4148W-7-F)
FAN2  Air Flow: 4.4CFM  Voltage: 5V  Power: 1W  [FAN_AFB0405LA-A]  (hidden comment: AFB0405LA-A)
HS2  Thermal Resistance: 2.2°C/W  [HEATSINK_CS9464020BP]  (hidden comment: CS9464020BP)
J10  value 1000V  Current: 24A  [Pomona_73099-2]  (hidden comment: 73099-2)
J11  value 1000V  Current: 24A  [Pomona_73099-0]  (hidden comment: 73099-0)
LED2  value 2V  Current: 10mA  [LED_0805]  (hidden comment: LTST-C170EKT)
Q6  value 30V  Current: 6.2A  [SOT-23]  (hidden comment: DMN3023L-7)
Q10  value 60V  Current: 115mA  [SOT-23]  (hidden comment: 2N7002-7-F)
R26  value 0  Power: .25W  [RES_0805]  (hidden comment: RC0805JR-070RL)
R28  value 0  Power: .25W  [RES_0805]  (hidden comment: RC0805JR-070RL)
R29  value 300  Power: .125W  Tolerance: 1%  [RES_0805]  (hidden comment: RC0805FR-07300RL)
R36  value 0  Power: .25W  [RES_0805]  (hidden comment: RC0805JR-070RL)
R37  value 10K  Power: .25W  Tolerance: 1%  [RES_0805]  (hidden comment: RC0805FR-7W10KL)
R38  value 10K  Power: .25W  Tolerance: 1%  [RES_0805]  (hidden comment: RC0805FR-7W10KL)
R71  value 0.0065  Tolerance: 1%  Power: 2W  [RES_2512]  (hidden comment: WSL25126L500FEA18)
R74  value 10  Power: .125W  Tolerance: 1%  [RES_0805]  (hidden comment: RC0805FR-1310RL)
REL5  value 5V  Current: 10A  [G5LE]  (hidden comment: G5LE-1-36 DC5)
U13  value 50V/V  Common Mode: -14V To +80V  [SOIC-8_54]  (hidden comment: INA282AIDR)
U16  SN74LVC1G14DCKR  [SOT-353]
U17  value GBP 0.9MHz  Vos: Vos 1000uV  Peak / Contineous Current: 10A / 8A  [POWER_PACKAGE_11]  (hidden comment: OPA549S)

### Nets
1V65: R74.2
3V3: C41.1 U13.6(VDD)
5V: C46.1 D16.2(K) D21.2(K) FAN2.1 REL5.2 U16.5
+VSW: C32.1 C35.1 D22.2(K) U17.10 U17.11
-VSW: C38.1 C47.1 D17.1(A) U17.5 U17.7
GND: C32.2 C35.2 C38.2 C41.2 C42.2 C46.2 C47.2 J11.1(-NEG) LED2.K Q6.2(E) Q10.2(E) R26.1 R36.1 R37.1 R38.1 U13.2(GND) U16.3 U17.6
ATTN_2: U17.4(+)
EN_FAN_2: Q6.1(B) R37.2
EN_VO_2: Q10.1(B) R38.2
IO_MON_2: U13.5(OUT)
VOUT_2: R71.2 REL5.1(COM) U13.1(IN-)
VOUT_SW_2: J10.1(+POS) REL5.3(NO)
NetC42_1: C42.1 R74.1 U13.3(REF2) U13.7(REF1)
NetD16_1: D16.1(A) Q10.3(C) REL5.5
NetD17_2: D17.2(K) D22.1(A) R28.2 R71.1 U13.8(IN+) U17.1 U17.2
NetD21_1: D21.1(A) FAN2.2 Q6.3(C)
NetLED2_A: LED2.A R29.2
NetR26_2: R26.2 R28.1 U17.3(-)
NetR29_1: R29.1 U16.4(Y)
NetR36_2: R36.2 U17.8
NetU16_2: U16.2(A) U17.9

Not connected (* = marked no-connect by the designer): REL5 4(NC); U13 4(NC)

### Notes on the sheet
- (near R26) DNP
- TEMP SHUTDOWN CH 2
- (near REL5) OUTPUT CONNECT
- (near J11) CH2 OUTPUT
- CURRENT BOOST CH 2
- OUTPUT I SENSE
- NOTES:
- 1V65 AVAILABLE WITH 5V
- FAN CONTROL CH 2
- 3V3 AVAILABLE WITH 5V AND MODULE INSTALLED
- DEVICE SHUT DOWN AND LED TURNS ON WHEN JUNCTION TEMP REACHES 160°C
- DEVICE TURNS BACK ON WHEN JUNCTION TEMP COOLS TO 140°C
- OP AMP BOOST GAIN TO BE UNITY
- Title
- Size:
- Date:
- B
- Number:
- Time:
- Revision:
- Sheet
- of
- IMR Engineering
- Engineer:
- File:
- (in symbol IC_SN74LVC1G14DCKR) +; -

### Library data of the parts
C32 C47 = CAP_SMD_100UF_25V_SMD: as C30 on sheet ArbPwrBoost_P4; Case/Package: CAPC6153X670N; MFG_PN: KCM55WC71E107MH13L; Supplier 1: DigiKey; Supplier Part Number 1: 490-KCM55WC71E107MH13LCT-ND; Unit Price: 5.68
C35 C38 C41 C46 = CAP_SMD_0.1UF_50V_0805: as C5 on sheet ArbPwrBoost_P2; Case/Package: 0805; MFG_PN: KGM21NR71H104KT; Supplier 1: DigiKey; Supplier Part Number 1: 478-KGM21NR71H104KTCT-ND; Unit Price: .1
C42 = CAP_SMD_1UF_50V_0805: as C28 on sheet ArbPwrBoost_P4; Case/Package: 0805; MFG_PN: 08055C105K4T2A; Supplier 1: DigiKey; Supplier Part Number 1: 478-KAM21KR71H105KUCT-ND; Unit Price: .27
D16 D17 D21 D22 = DIODE_1N4148W-7-F: as D2 on sheet ArbPwrBoost_P2; Case/Package: SOD-123; Supplier 1: DigiKey; Supplier Part Number 1: 1N4148W-FDICT-ND; Unit Price: .16; MFG_PN: 1N4148W-7-F
FAN2 = FAN_AFB0405LA-A: as FAN1 on sheet ArbPwrBoost_P4; Case/Package: 40x40x10mm; Supplier 1: DigiKey; Supplier Part Number 1: 603-2014-ND; Unit Price: 7.31; MFG_PN: AFB0405LA-A
HS2 = HEATSINK_CS9464020BP: as HS1 on sheet ArbPwrBoost_P4; Case/Package: 40x40x20mm; Supplier 1: DigiKey; Supplier Part Number 1: 4165-CS9464020BP-ND; Unit Price: 3.41; MFG_PN: CS9464020BP
J10 = CONN_PANOMA_73099-2: as J1 on sheet ArbPwrBoost_P2; Case/Package: 73099-2; Supplier 1: DigiKey; Supplier Part Number 1: 501-73099-2-ND; Unit Price: 10.39; MFG_PN: 73099-2
J11 = CONN_PANOMA_73099-0: as J2 on sheet ArbPwrBoost_P2; Case/Package: 73099-0; Supplier 1: DigiKey; Supplier Part Number 1: 501-73099-0-ND; Unit Price: 10.39; MFG_PN: 73099-0
LED2 = LED_RED_LTST-C170EKT: LED RED CLEAR SMD; MFG: Diodes Inc; Case/Package: 0805; Supplier 1: DigiKey; Supplier Part Number 1: 160-1178-1-ND; Unit Price: .18; MFG_PN: LTST-C170EKT
Q6 = MOSFET_NCH_DMN3023L-7: as Q5 on sheet ArbPwrBoost_P4; Case/Package: SOT-23; Supplier 1: DigiKey; Supplier Part Number 1: DMN3023L-7DICT-ND; Unit Price: .48; MFG_PN: DMN3023L-7
Q10 = MOSFET_NCH_2N7002-7-F: as Q3 on sheet ArbPwrBoost_P2; Case/Package: SOT-23; Supplier 1: DigiKey; Supplier Part Number 1: 2N7002-FDICT-ND; Unit Price: .20; MFG_PN: 2N7002-7-F
R26 R28 R36 = RES_SMD_0_0805_1/8W_1%: RES SMD 0 OHM 1% 1/8W 0805; MFG: Yageo; Case/Package: 0805; MFG_PN: RC0805JR-070RL; Supplier 1: DigiKey; Supplier Part Number 1: 311-0.0ARCT-ND; Unit Price: .1; Tolerance: 1%
R29 = RES_SMD_300_0805_1/8W_1%: RES SMD 300 OHM 1% 1/8W 0805; MFG: Yageo; Case/Package: 0805; MFG_PN: RC0805FR-07300RL; Supplier 1: DigiKey; Supplier Part Number 1: 311-300CRCT-ND; Unit Price: .1
R37 R38 = RES_SMD_10K_0805_1/4W_1%: RES SMD 10K OHM 1% 1/4W 0805; MFG: Yageo; Case/Package: 0805; MFG_PN: RC0805FR-7W10KL; Supplier 1: DigiKey; Supplier Part Number 1: 13-RC0805FR-7W10KLCT-ND; Unit Price: .10
R71 = RES_SMD_0.0065_2512_2W_1%: as R39 on sheet ArbPwrBoost_P4; Case/Package: 2512; MFG_PN: WSL25126L500FEA18; Supplier 1: DigiKey; Supplier Part Number 1: 541-WSL25126L500FEA18CT-ND; Unit Price: 1.76
R74 = RES_SMD_10_0805_1/8W_1%: RES SMD 10 OHM 1% 1/8W 0805; MFG: Yageo; Case/Package: 0805; MFG_PN: RC0805FR-1310RL; Supplier 1: DigiKey; Supplier Part Number 1: 13-RC0805FR-1310RLCT-ND; Unit Price: .1
REL5 = RELAY_G5LE-1-36 DC5: as REL3 on sheet ArbPwrBoost_P4; Case/Package: G5LE; Supplier 1: DigiKey; Supplier Part Number 1: G5LE-1-36DC5-ND; Unit Price: 1.24; Supplier: DigiKey; Manufacturer: Omron; MFG_PN: G5LE-1-36 DC5
U13 = IC_INA282AIDR: as U8 on sheet ArbPwrBoost_P4; Case/Package: SOIC-8; Supplier 1: DigiKey; Supplier Part Number 1: 296-27820-1-ND; Unit Price: 4.13; MFG_PN: INA282AIDR
U16 = IC_SN74LVC1G14DCKR: as U5 on sheet ArbPwrBoost_P4; Unit Price: .10; Package/Case: SC70-5; Supplier 1: DigiKey; Supplier Part Number 1: 296-11608-1-ND; MFG_PN: SN74LVC1G14DCKR
U17 = OPAMP_OPA549S: as U12 on sheet ArbPwrBoost_P4; Unit Price: 26.94; Package/Case: Power Package-11; Supplier 1: DigiKey; Supplier Part Number 1: OPA549S-ND; MFG_PN: OPA549S